# EAGLE board PCIe-1x-Toolcard (EAGLE 9.2.1), part 1 of 3
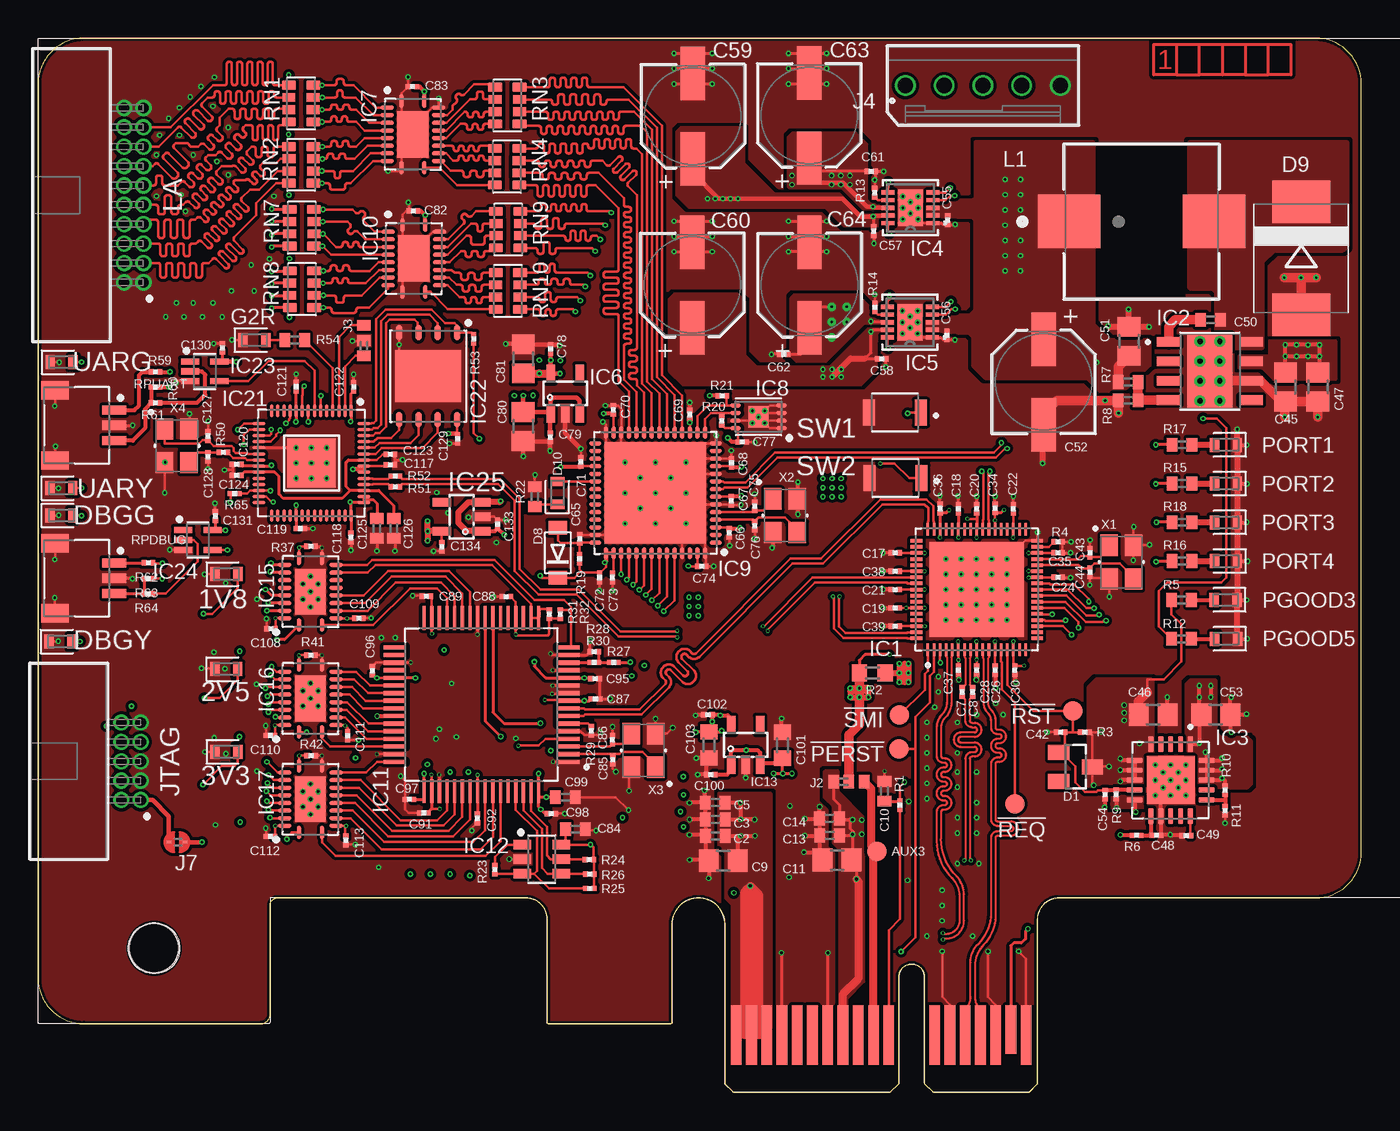
[diagram p8: board, top side]
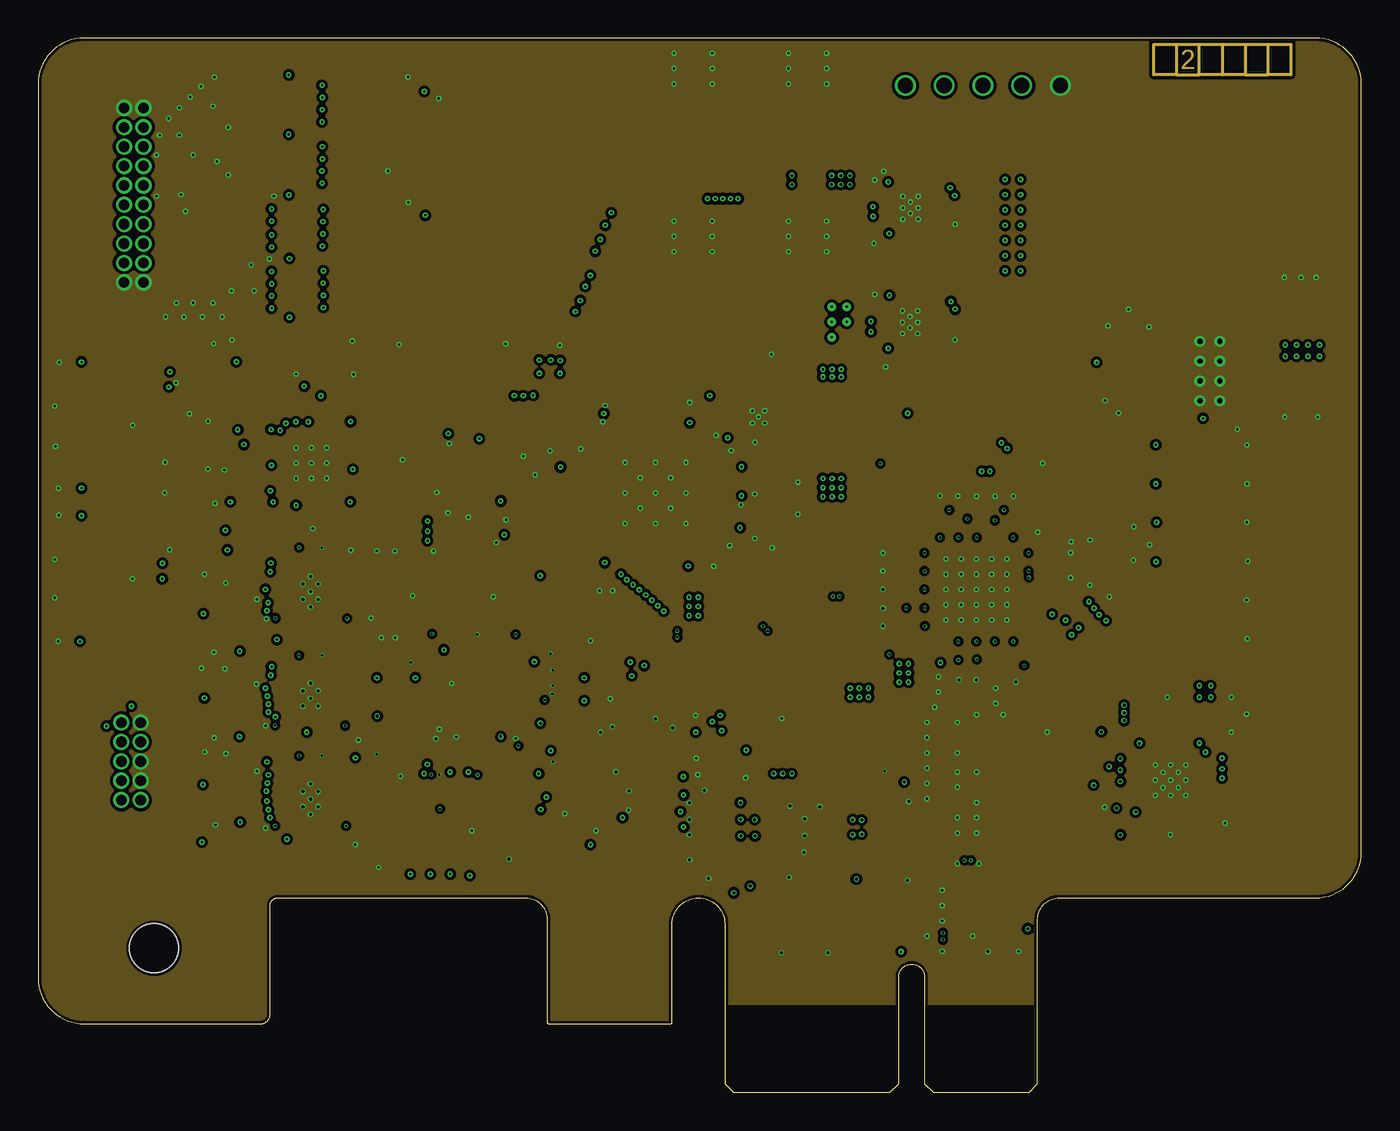
[diagram p9: board, inner layer GND-1]
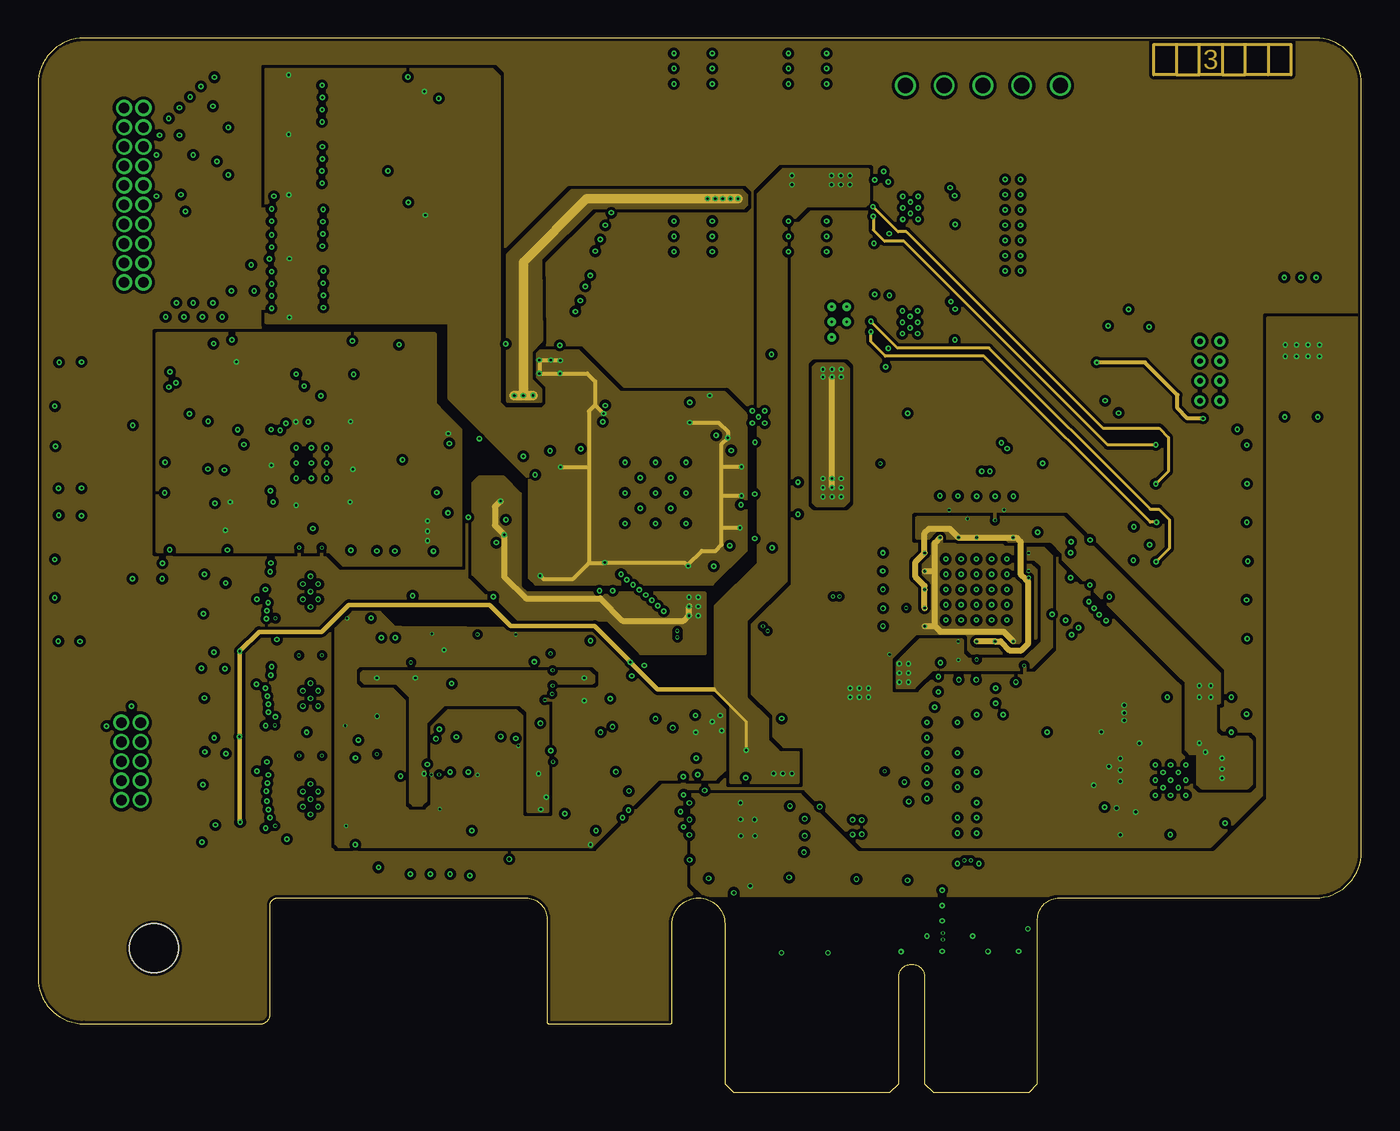
[diagram p10: board, inner layer PWR]
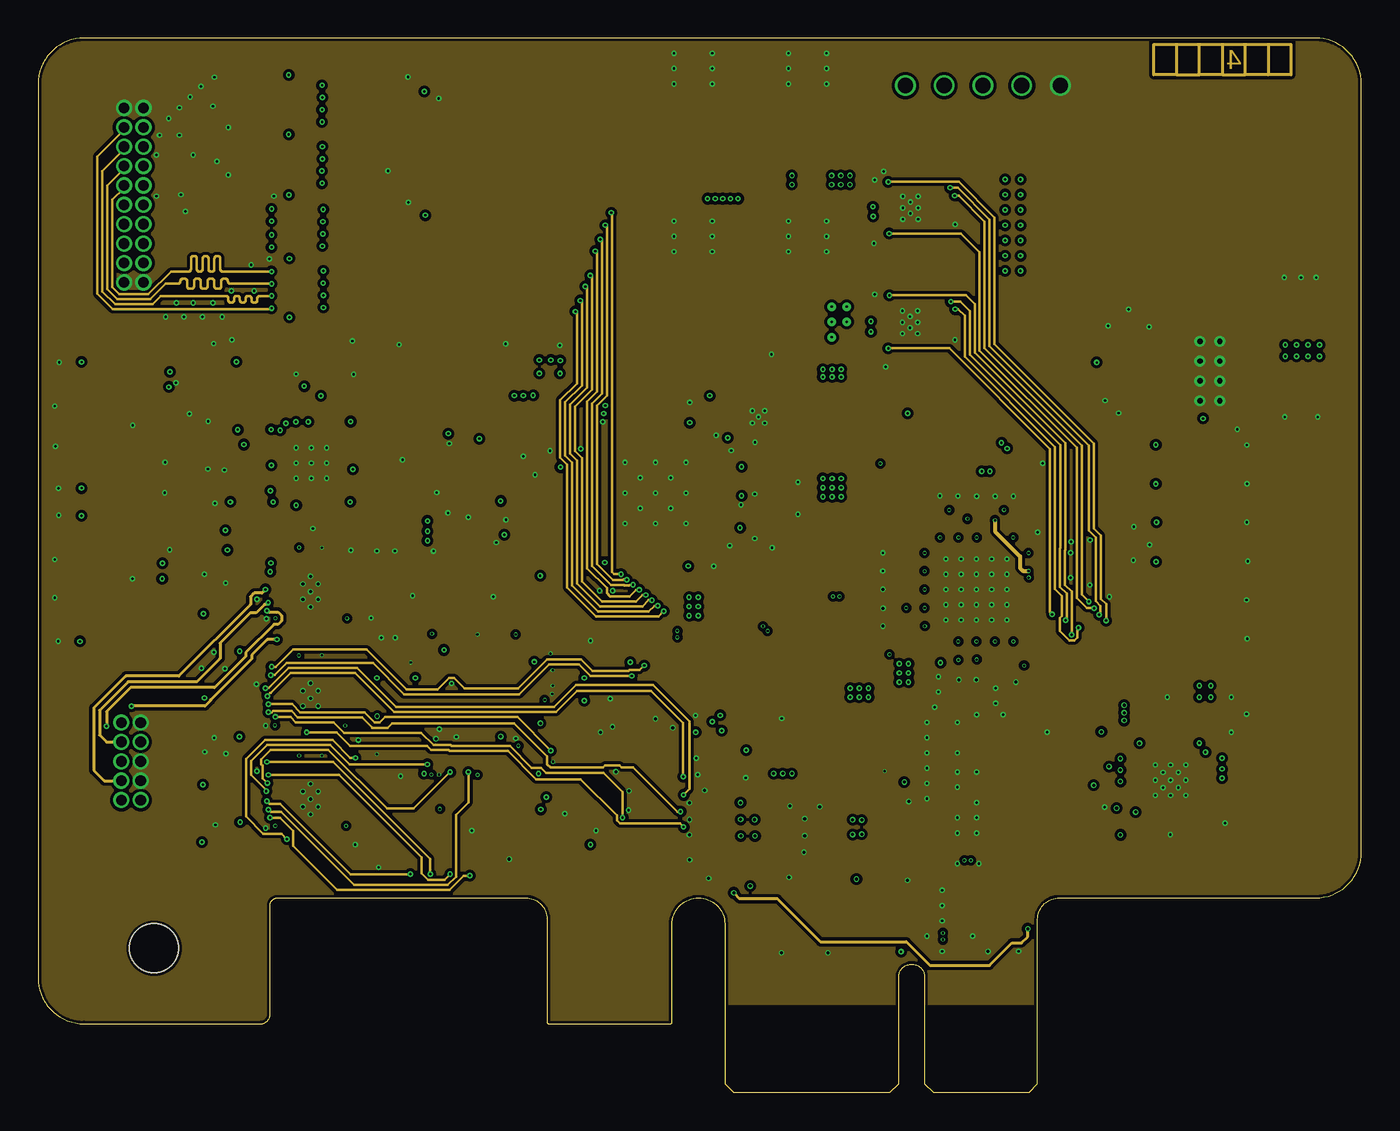
[diagram p11: board, inner layer SIGNAL]
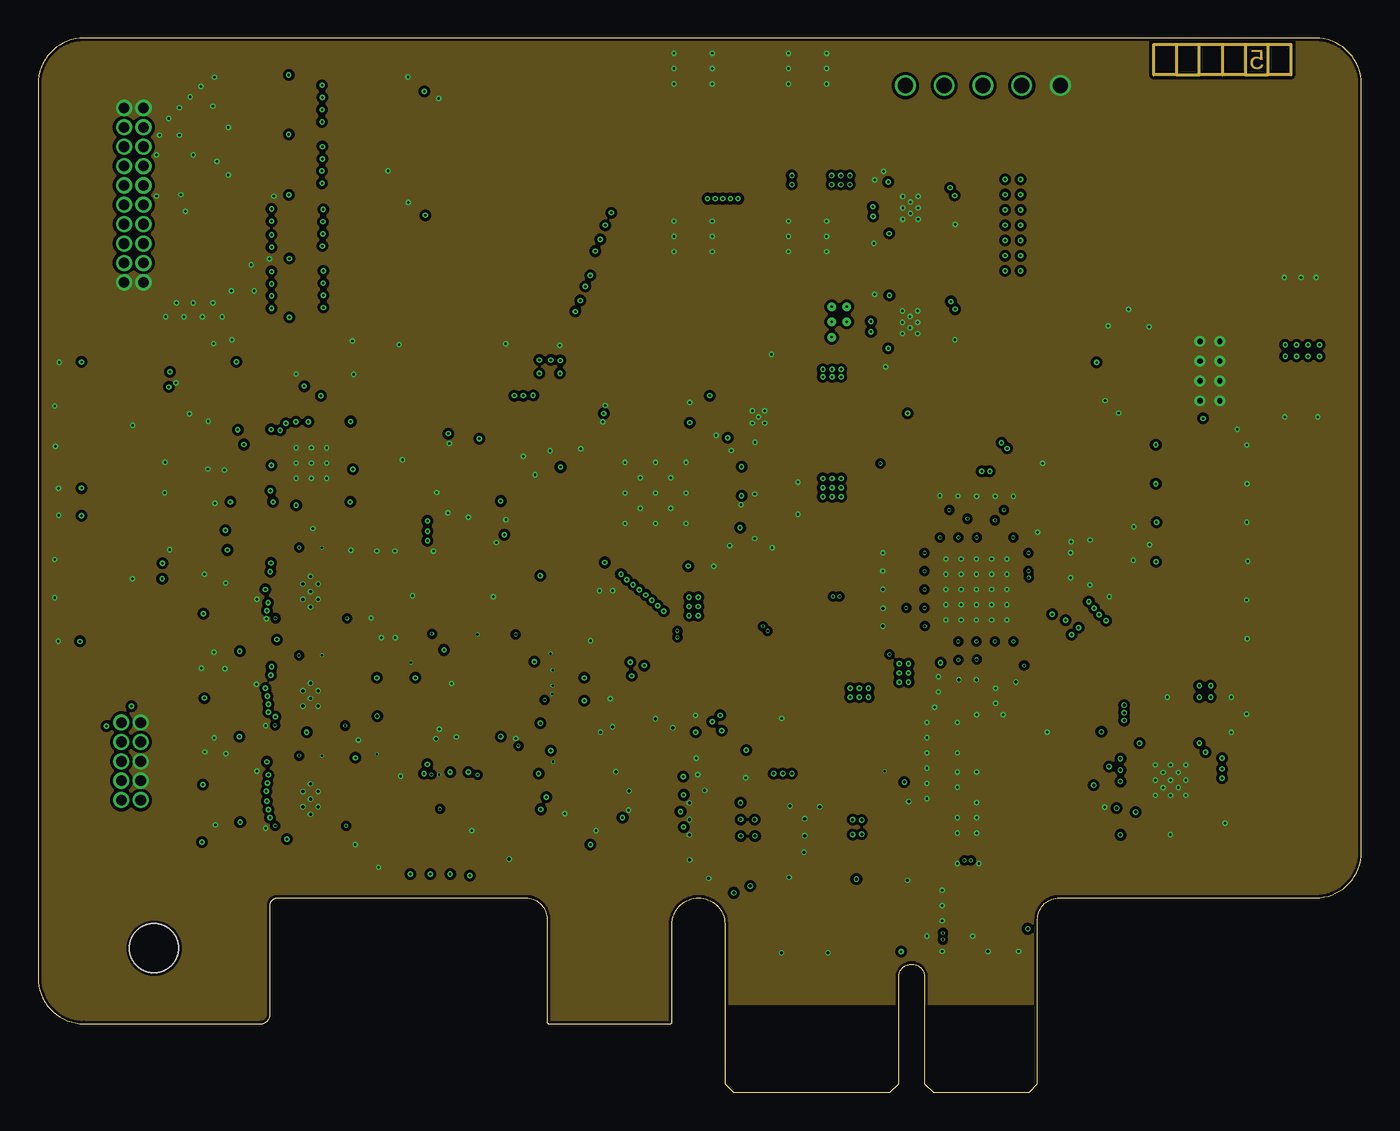
[diagram p12: board, inner layer GND-2]
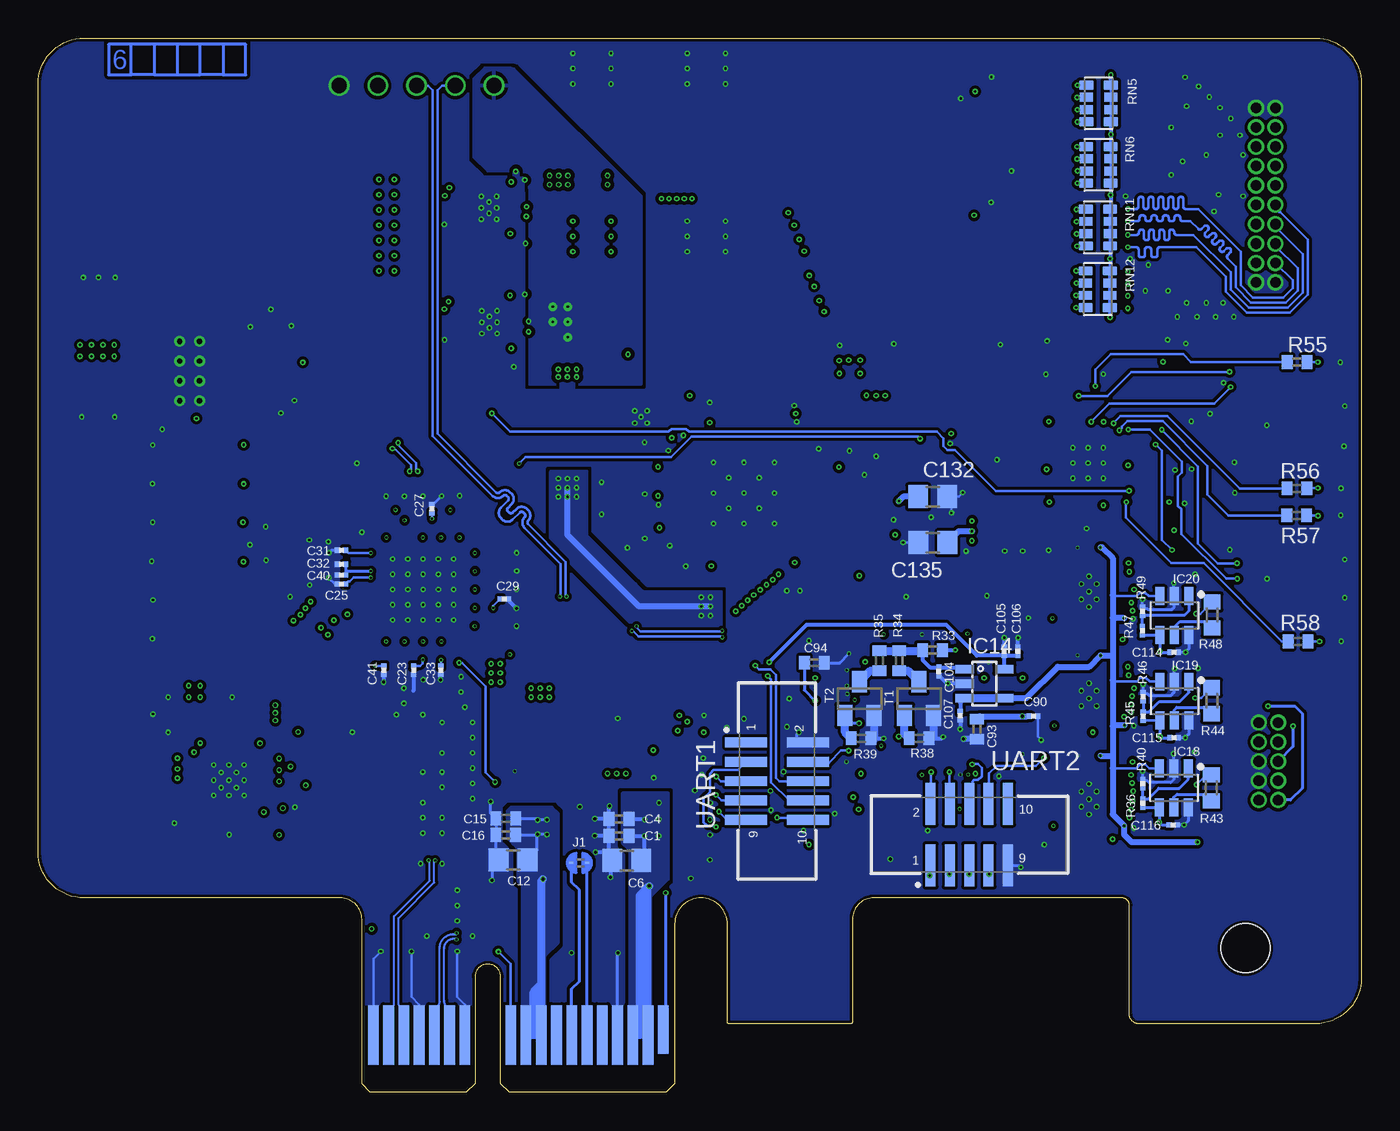
[diagram p13: board, bottom side, seen from below]

Size 86.72 x 69.1 mm. Coordinates in mm from the lower left corner, seen from the top.
Outline: 83.72,69.1 3,69.1 arc90 0,66.1 0,7.5 arc90 3,4.5 14.59,4.5 arc90 15.2,5.11 15.2,12.26 arc-90 15.69,12.75 31.96,12.75 arc-90 33.35,11.37 33.35,4.61 arc90 33.46,4.5 41.44,4.5 arc90 41.55,4.61 41.55,11.03 arc-90 43.27,12.75 43.29,12.75 arc-90 45,11.04 45,0.56 45.56,0 55.84,0 56.4,0.56 56.4,7.56 arc-90 57.25,8.41 arc-90 58.1,7.56 58.1,0.56 58.66,0 64.95,0 65.5,0.55 65.5,11.33 arc-90 66.92,12.75 83.72,12.75 arc90 86.72,15.75 86.72,66.1 arc90 83.72,69.1
Copper layers (1+2*3+14*15+16): SIGNAL-HS 0.035mm / dielectric 0.0994mm / GND-1 0.0152mm / dielectric 0.55mm / PWR 0.0152mm / dielectric 0.1088mm / SIGNAL 0.0152mm / dielectric 0.55mm / GND-2 0.0152mm / dielectric 0.0994mm / SIGNAL-HS2 0.035mm
Design rules "JLC06161H-3313A_6-layer_1.6 mm *": minimum track width 0.1mm, minimum drill 0.15mm, track to track 3.5mil, track to pad 3.5mil, pad to pad 3.5mil, via to via 3.5mil, smd to smd 3.5mil, copper to edge 0.2mm, drill to drill 6mil, minimum pad ring 7mil, minimum via ring 0.05mm, stop-mask expansion 0.05mm, vias tented up to drill 16mil, thermal gap 10mil
Net classes: 0 50R_SE: width 0.149 mm, drill 0.15 mm, clearance 0.178 mm; 1 90R_DE: width 0.149 mm, drill 0.15 mm, clearance 0.178 mm; 2 100R_DE: width 0.115 mm, drill 0.15 mm, clearance 0.178 mm; 3 50R_SE_INNER: width 0.369 mm, drill 0.15 mm, clearance 0.178 mm

## Footprints (pad centres in the part's own frame; a part is rotated, then mirrored left to right if it is on the bottom)
LED-0603 = smd 0.612 x 0.912: A 0.75,0; C -0.75,0
B1,27 = smd 1.27 x 1.27: TP 0,0
0402 = smd 0.7 x 0.9: 1 -0.65,0; 2 0.65,0
0805 = smd 1.3 x 1.5: 1 -0.95,0; 2 0.95,0
0201 = smd 0.34 x 0.35: 1 -0.275,0; 2 0.275,0
C0402 = smd 0.7 x 0.9: 1 -0.65,0; 2 0.65,0
6.3X7.7(DXL) = smd 3.5 x 1.6: 1 2.8,0; 2 -2.8,0
6.3X5.5(DXL) = smd 3.5 x 1.6: 1 2.8,0; 2 -2.8,0
0603 = smd 1 x 1.1: 1 -0.85,0; 2 0.85,0
SOT23 = smd 1 x 1.4: 1 -0.95,-1.1; 2 0.95,-1.1; 3 0,1.1
SOD-123FL = smd 0.91 x 1.22: A 1.637,0; C -1.637,0
SMC = smd 2.8 x 3.8: A 3.7,0; C -3.7,0
QFN68-8X8 = smd 0.81 x 0.22: 1 -3.95,3.2; 2 -3.95,2.8; 3 -3.95,2.4; 4 -3.95,2; 5 -3.95,1.6; 6 -3.95,1.2; 7 -3.95,0.8; 8 -3.95,0.4; 9 -3.95,0; 10 -3.95,-0.4; 11 -3.95,-0.8; 12 -3.95,-1.2; 13 -3.95,-1.6; 14 -3.95,-2; 15 -3.95,-2.4; 16 -3.95,-2.8; 17 -3.95,-3.2; 35 3.95,-3.2; 36 3.95,-2.8; 37 3.95,-2.4; 38 3.95,-2; 39 3.95,-1.6; 40 3.95,-1.2; 41 3.95,-0.8; 42 3.95,-0.4; 43 3.95,0; 44 3.95,0.4; 45 3.95,0.8; 46 3.95,1.2; 47 3.95,1.6; 48 3.95,2; 49 3.95,2.4; 50 3.95,2.8; 51 3.95,3.2 | smd 0.22 x 0.81: 18 -3.2,-3.95; 19 -2.8,-3.95; 20 -2.4,-3.95; 21 -2,-3.95; 22 -1.6,-3.95; 23 -1.2,-3.95; 24 -0.8,-3.95; 25 -0.4,-3.95; 26 0,-3.95; 27 0.4,-3.95; 28 0.8,-3.95; 29 1.2,-3.95; 30 1.6,-3.95; 31 2,-3.95; 32 2.4,-3.95; 33 2.8,-3.95; 34 3.2,-3.95; 52 3.2,3.95; 53 2.8,3.95; 54 2.4,3.95; 55 2,3.95; 56 1.6,3.95; 57 1.2,3.95; 58 0.8,3.95; 59 0.4,3.95; 60 0,3.95; 61 -0.4,3.95; 62 -0.8,3.95; 63 -1.2,3.95; 64 -1.6,3.95; 65 -2,3.95; 66 -2.4,3.95; 67 -2.8,3.95; 68 -3.2,3.95 | smd 6.2 x 6.2: 69 0,0
8-POWERSOIC = smd 1.55 x 0.6: 1 -2.7,1.905; 2 -2.7,0.635; 3 -2.7,-0.635; 4 -2.7,-1.905; 5 2.7,-1.905; 6 2.7,-0.635; 7 2.7,0.635; 8 2.7,1.905 | smd 2.95 x 4.9: PAD 0,0 | drill 0.35 pad 0.61: V1 -0.65,1.95; V2 0.65,1.95; V3 -0.65,0.65; V4 0.65,0.65; V5 -0.65,-0.65; V6 0.65,-0.65; V7 -0.65,-1.95; V8 0.65,-1.95
VQFN20-5X5 = smd 1.05 x 0.34: 1 -2.36,1.3; 2 -2.36,0.65; 3 -2.36,0; 4 -2.36,-0.65; 5 -2.36,-1.3; 11 2.36,-1.3; 12 2.36,-0.65; 13 2.36,0; 14 2.36,0.65; 15 2.36,1.3 | smd 0.34 x 1.05: 6 -1.3,-2.36; 7 -0.65,-2.36; 8 0,-2.36; 9 0.65,-2.36; 10 1.3,-2.36; 16 1.3,2.36; 17 0.65,2.36; 18 0,2.36; 19 -0.65,2.36; 20 -1.3,2.36 | smd 3.15 x 3.15: 21 0,0
VSON10-3X3 = smd 0.85 x 0.28: 1 -1.475,1; 2 -1.475,0.5; 3 -1.475,0; 4 -1.475,-0.5; 5 -1.475,-1; 6 1.475,-1; 7 1.475,-0.5; 8 1.475,0; 9 1.475,0.5; 10 1.475,1 | smd 1.65 x 2.4: PAD 0,0
SOT23-5 = smd 0.55 x 1.2: 1 -0.95,-1.3; 2 0,-1.3; 3 0.95,-1.3; 4 0.95,1.3; 5 -0.95,1.3
QFN50P350X450X100-25T305X205N = smd 0.264 x 0.896: 1 -0.75,2.187; 10 -0.75,-2.187; 11 0.75,-2.187; 20 0.75,2.187 | smd 0.896 x 0.264: 2 -1.687,1.75; 3 -1.687,1.25; 4 -1.687,0.75; 5 -1.687,0.25; 6 -1.687,-0.25; 7 -1.687,-0.75; 8 -1.687,-1.25; 9 -1.687,-1.75; 12 1.687,-1.75; 13 1.687,-1.25; 14 1.687,-0.75; 15 1.687,-0.25; 16 1.687,0.25; 17 1.687,0.75; 18 1.687,1.25; 19 1.687,1.75 | smd 2.05 x 3.05: PAD 0,0
SON50P300X200X50-9T130X140N = smd 0.711 x 0.27: 1 -1.501,0.75; 2 -1.501,0.25; 3 -1.501,-0.25; 4 -1.501,-0.75; 5 1.501,-0.75; 6 1.501,-0.25; 7 1.501,0.25; 8 1.501,0.75 | smd 1.3 x 1.4: 9 0,0
QFN50P800X800X100-57T665 = smd 0.811 x 0.264: 1 -3.951,3.25; 2 -3.951,2.75; 3 -3.951,2.25; 4 -3.951,1.75; 5 -3.951,1.25; 6 -3.951,0.75; 7 -3.951,0.25; 8 -3.951,-0.25; 9 -3.951,-0.75; 10 -3.951,-1.25; 11 -3.951,-1.75; 12 -3.951,-2.25; 13 -3.951,-2.75; 14 -3.951,-3.25; 29 3.951,-3.25; 30 3.951,-2.75; 31 3.951,-2.25; 32 3.951,-1.75; 33 3.951,-1.25; 34 3.951,-0.75; 35 3.951,-0.25; 36 3.951,0.25; 37 3.951,0.75; 38 3.951,1.25; 39 3.951,1.75; 40 3.951,2.25; 41 3.951,2.75; 42 3.951,3.25 | smd 0.264 x 0.811: 15 -3.25,-3.951; 16 -2.75,-3.951; 17 -2.25,-3.951; 18 -1.75,-3.951; 19 -1.25,-3.951; 20 -0.75,-3.951; 21 -0.25,-3.951; 22 0.25,-3.951; 23 0.75,-3.951; 24 1.25,-3.951; 25 1.75,-3.951; 26 2.25,-3.951; 27 2.75,-3.951; 28 3.25,-3.951; 43 3.25,3.951; 44 2.75,3.951; 45 2.25,3.951; 46 1.75,3.951; 47 1.25,3.951; 48 0.75,3.951; 49 0.25,3.951; 50 -0.25,3.951; 51 -0.75,3.951; 52 -1.25,3.951; 53 -1.75,3.951; 54 -2.25,3.951; 55 -2.75,3.951; 56 -3.25,3.951 | smd 6.65 x 6.65: 57 0,0
LQFP64-10X10 = smd 1.56 x 0.28: 1 -5.68,3.75; 2 -5.68,3.25; 3 -5.68,2.75; 4 -5.68,2.25; 5 -5.68,1.75; 6 -5.68,1.25; 7 -5.68,0.75; 8 -5.68,0.25; 9 -5.68,-0.25; 10 -5.68,-0.75; 11 -5.68,-1.25; 12 -5.68,-1.75; 13 -5.68,-2.25; 14 -5.68,-2.75; 15 -5.68,-3.25; 16 -5.68,-3.75; 33 5.68,-3.75; 34 5.68,-3.25; 35 5.68,-2.75; 36 5.68,-2.25; 37 5.68,-1.75; 38 5.68,-1.25; 39 5.68,-0.75; 40 5.68,-0.25; 41 5.68,0.25; 42 5.68,0.75; 43 5.68,1.25; 44 5.68,1.75; 45 5.68,2.25; 46 5.68,2.75; 47 5.68,3.25; 48 5.68,3.75 | smd 0.28 x 1.56: 17 -3.75,-5.68; 18 -3.25,-5.68; 19 -2.75,-5.68; 20 -2.25,-5.68; 21 -1.75,-5.68; 22 -1.25,-5.68; 23 -0.75,-5.68; 24 -0.25,-5.68; 25 0.25,-5.68; 26 0.75,-5.68; 27 1.25,-5.68; 28 1.75,-5.68; 29 2.25,-5.68; 30 2.75,-5.68; 31 3.25,-5.68; 32 3.75,-5.68; 49 3.75,5.68; 50 3.25,5.68; 51 2.75,5.68; 52 2.25,5.68; 53 1.75,5.68; 54 1.25,5.68; 55 0.75,5.68; 56 0.25,5.68; 57 -0.25,5.68; 58 -0.75,5.68; 59 -1.25,5.68; 60 -1.75,5.68; 61 -2.25,5.68; 62 -2.75,5.68; 63 -3.25,5.68; 64 -3.75,5.68
SOT95P280X145-6N = smd 1.165 x 0.597: 1 -1.275,0.95; 2 -1.275,0; 3 -1.275,-0.95; 4 1.275,-0.95; 5 1.275,0; 6 1.275,0.95
VQFN24 = smd 0.264 x 0.896: 1 -0.75,-2.187; 10 -0.75,2.187; 11 0.75,2.187; 20 0.75,-2.187 | smd 0.896 x 0.264: 2 -1.687,-1.75; 3 -1.687,-1.25; 4 -1.687,-0.75; 5 -1.687,-0.25; 6 -1.687,0.25; 7 -1.687,0.75; 8 -1.687,1.25; 9 -1.687,1.75; 12 1.687,1.75; 13 1.687,1.25; 14 1.687,0.75; 15 1.687,0.25; 16 1.687,-0.25; 17 1.687,-0.75; 18 1.687,-1.25; 19 1.687,-1.75 | smd 2 x 3: PAD 0,0
QFN56 = smd 0.837 x 0.22: 1 -3.437,2.6; 2 -3.437,2.2; 3 -3.437,1.8; 4 -3.437,1.4; 5 -3.437,1; 6 -3.437,0.6; 7 -3.437,0.2; 8 -3.437,-0.2; 9 -3.437,-0.6; 10 -3.437,-1; 11 -3.437,-1.4; 12 -3.437,-1.8; 13 -3.437,-2.2; 14 -3.437,-2.6; 29 3.437,-2.6; 30 3.437,-2.2; 31 3.437,-1.8; 32 3.437,-1.4; 33 3.437,-1; 34 3.437,-0.6; 35 3.437,-0.2; 36 3.437,0.2; 37 3.437,0.6; 38 3.437,1; 39 3.437,1.4; 40 3.437,1.8; 41 3.437,2.2; 42 3.437,2.6 | smd 0.22 x 0.837: 15 -2.6,-3.437; 16 -2.2,-3.437; 17 -1.8,-3.437; 18 -1.4,-3.437; 19 -1,-3.437; 20 -0.6,-3.437; 21 -0.2,-3.437; 22 0.2,-3.437; 23 0.6,-3.437; 24 1,-3.437; 25 1.4,-3.437; 26 1.8,-3.437; 27 2.2,-3.437; 28 2.6,-3.437; 43 2.6,3.437; 44 2.2,3.437; 45 1.8,3.437; 46 1.4,3.437; 47 1,3.437; 48 0.6,3.437; 49 0.2,3.437; 50 -0.2,3.437; 51 -0.6,3.437; 52 -1,3.437; 53 -1.4,3.437; 54 -1.8,3.437; 55 -2.2,3.437; 56 -2.6,3.437 | smd 3.2 x 3.2: PAD 0,0
SON127P600X500X75-8N = smd 1.012 x 0.432: 1 -2.85,1.905; 2 -2.85,0.635; 3 -2.85,-0.635; 4 -2.85,-1.905; 5 2.85,-1.905; 6 2.85,-0.635; 7 2.85,0.635; 8 2.85,1.905 | smd 3.4 x 4.3: PAD 0,0
SOT353-1 = smd 1.186 x 0.397: 1 -0.962,0.65; 2 -0.962,0; 3 -0.962,-0.65; 4 0.962,-0.65; 5 0.962,0.65
J-0402-NO = smd 0.305 x 0.152: 1 -0.5,0; 2 0.55,0
JUMPER-3 = smd 0.7 x 0.9: 1 -0.65,0; 2 0.35,0; 3 1.35,0
66100511622 = drill 1: 1 5.08,0; 2 2.54,0; 3 0,0; 4 -2.54,0; 5 -5.08,0
62701021721 = drill 0.7 pad 1.05: 1 2.54,4.72; 2 2.54,3.45; 3 1.27,4.72; 4 1.27,3.45; 5 0,4.72; 6 0,3.45; 7 -1.27,4.72; 8 -1.27,3.45; 9 -2.54,4.72; 10 -2.54,3.45
L-10X10 = smd 4.1 x 3.5: 1 -4.75,0; 2 4.75,0
62702021721 = drill 0.7 pad 1.05: 1 5.715,4.72; 2 5.715,3.45; 3 4.445,4.72; 4 4.445,3.45; 5 3.175,4.72; 6 3.175,3.45; 7 1.905,4.72; 8 1.905,3.45; 9 0.635,4.72; 10 0.635,3.45; 11 -0.635,4.72; 12 -0.635,3.45; 13 -1.905,4.72; 14 -1.905,3.45; 15 -3.175,4.72; 16 -3.175,3.45; 17 -4.445,4.72; 18 -4.445,3.45; 19 -5.715,4.72; 20 -5.715,3.45
PCIE_X1_LOWPROFILE = smd 0.7 x 3.2 bottom: A1 45.75,-0.38 | smd 0.7 x 3.91 bottom: A2 46.75,-0.735; A3 47.75,-0.735; A4 48.75,-0.735; A5 49.75,-0.735; A6 50.75,-0.735; A7 51.75,-0.735; A8 52.75,-0.735; A9 53.75,-0.735; A10 54.75,-0.735; A11 55.75,-0.735; A12 58.75,-0.735; A13 59.75,-0.735; A14 60.75,-0.735; A15 61.75,-0.735; A16 62.75,-0.735; A17 63.75,-0.735; A18 64.75,-0.735 | smd 0.7 x 3.91: B1 45.75,-0.735; B2 46.75,-0.735; B3 47.75,-0.735; B4 48.75,-0.735; B5 49.75,-0.735; B6 50.75,-0.735; B7 51.75,-0.735; B8 52.75,-0.735; B9 53.75,-0.735; B10 54.75,-0.735; B11 55.75,-0.735; B12 58.75,-0.735; B13 59.75,-0.735; B14 60.75,-0.735; B15 61.75,-0.735; B16 62.75,-0.735; B18 64.75,-0.735 | smd 0.7 x 3.2: B17 63.75,-0.38 | hole 3.2: 7.6,4.95
0603X4-1206 = smd 0.59 x 0.92: A1 -1.2,-0.8; A2 -1.2,0.8; B1 -0.4,-0.8; B2 -0.4,0.8; C1 0.4,-0.8; C2 0.4,0.8; D1 1.2,-0.8; D2 1.2,0.8
SM03B-SRSS-TB = smd 0.6 x 1.55: 1 -1,2.54; 2 0,2.54; 3 1,2.54 | smd 1.2 x 1.8: S1 -2.3,-1.335; S2 2.3,-1.335
B3U-1000P = smd 0.8 x 1.7: 1 -1.7,0; 2 1.7,0
62731020621 = smd 0.65 x 2.76: 1 -2.54,-2.02; 2 -2.54,2.02; 3 -1.27,-2.02; 4 -1.27,2.02; 5 0,-2.02; 6 0,2.02; 7 1.27,-2.02; 8 1.27,2.02; 9 2.54,-2.02; 10 2.54,2.02
WE-XTAL_CFPX-180 = smd 1.4 x 1.15: 1 -1.1,-0.8; 2 1.1,-0.8; 3 1.1,0.8; 4 -1.1,0.8

## Placement (x,y rotation side)
1V8  Green  [LED-0603]  12.34,33.97 0 top
2V5  Green  [LED-0603]  12.33,27.75 0 top
3V3  Green  [LED-0603]  12.34,22.33 0 top
!PERST  TPB1,27  [B1,27]  56.42,22.51 90 top
!REQ  TPB1,27  [B1,27]  64.01,18.9 0 top
!RST  TPB1,27  [B1,27]  67.8,25.01 0 top
!SMI  TPB1,27  [B1,27]  56.46,24.74 90 top
AUX3  TPB1,27  [B1,27]  54.96,15.8 0 top
C1  100nF 25V  [0402]  48.65,16.82 180 bottom
C2  100nF 25V  [0402]  44.39,16.81 180 top
C3  100nF 25V  [0402]  44.38,17.9 180 top
C4  100nF 25V  [0402]  48.65,17.92 180 bottom
C5  100nF 25V  [0402]  44.37,19 180 top
C6  10uF 50V  [0805]  48.14,15.2 180 bottom
C7  100nF 16V  [0201]  60.56,26.25 270 top
C8  100nF 16V  [0201]  61.25,26.25 270 top
C9  10uF 50V  [0805]  44.9,15.19 180 top
C10  1nF  [C0402]  55.47,19.74 90 top
C11  10uF 50V  [0805]  52.36,15.23 180 top
C12  10uF 50V  [0805]  55.59,15.24 180 bottom
C13  100nF 25V  [0402]  51.87,16.84 180 top
C14  100nF 25V  [0402]  51.86,17.96 180 top
C15  100nF 25V  [0402]  56.07,17.96 180 bottom
C16  100nF 25V  [0402]  56.08,16.88 180 bottom
C17  10nF 16V  [0201]  56.18,35.36 180 top
C18  10nF 16V  [0201]  60.31,38.26 90 top
C19  10nF 16V  [0201]  56.17,31.75 180 top
C20  10nF 16V  [0201]  61.51,38.26 90 top
C21  10nF 16V  [0201]  56.17,32.96 180 top
C22  10nF 16V  [0201]  63.91,38.26 90 top
C23  100nF 16V  [0201]  62.11,27.67 270 bottom
C24  10nF 16V  [0201]  66.85,33.76 0 top
C25  100nF 16V  [0201]  66.85,33.32 180 bottom
C26  10nF 16V  [0201]  62.72,27.67 270 top
C27  100nF 16V  [0201]  60.91,38.26 90 bottom
C28  10nF 16V  [0201]  61.51,27.67 270 top
C29  100nF 16V  [0201]  56.16,32.34 0 bottom
C30  10nF 16V  [0201]  64.01,27.68 270 top
C31  100nF 16V  [0201]  66.84,35.54 180 bottom
C32  10nF 16V  [0201]  66.84,34.62 180 bottom
C33  100nF 16V  [0201]  60.33,27.67 270 bottom
C34  10nF 16V  [0201]  62.71,38.28 90 top
C35  10nF 16V  [0201]  66.84,35.36 0 top
C36  10nF 16V  [0201]  59.11,38.27 90 top
C37  10nF 16V  [0201]  60.31,27.67 270 top
C38  10nF 16V  [0201]  56.17,34.16 180 top
C39  10nF 16V  [0201]  56.17,30.56 180 top
C40  100nF 16V  [0201]  66.84,33.91 180 bottom
C41  100nF 16V  [0201]  64.06,27.68 270 bottom
C42  1uF 16V  [0201]  67,23.61 180 top
C43  8pF 50V  [0201]  68.93,35.37 90 top
C44  8pF 50V  [0201]  68.93,34.08 270 top
C45  22uF 25V  [0805]  81.75,46.23 270 top
C46  10uF 16V  [0805]  73.07,24.76 0 top
C47  10nF 50V  [0805]  83.87,46.24 270 top
C48  10nF 16V  [0201]  73.29,16.85 0 top
C49  DNI  [0201]  75.25,16.84 180 top
C50  10nF 25V  [0402]  76.84,50.64 0 top
C51  10nF 50V  [0805]  71.49,49.23 90 top
C52  330uF 25V  [6.3X7.7(DXL)]  65.9,46.57 90 top
C53  22uF 16V  [0805]  77.18,24.76 0 top
C54  100nF 16V  [0201]  69.93,19.52 270 top
C55  100nF 16V  [0201]  59.6,57.17 270 top
C56  100nF 16V  [0201]  59.56,49.61 270 top
C57  100nF 16V  [0201]  54.77,56.45 270 top
C58  100nF 16V  [0201]  55.27,48.07 0 top
C59  150uF 35V  [6.3X5.5(DXL)]  42.91,63.99 270 top
C60  150uF 35V  [6.3X5.5(DXL)]  42.86,52.92 270 top
C61  100nF 16V  [0201]  54.59,60.37 0 top
C62  100nF 16V  [0201]  48.87,48.38 180 top
C63  150uF 35V  [6.3X5.5(DXL)]  50.53,64.03 270 top
C64  150uF 35V  [6.3X5.5(DXL)]  50.55,52.91 270 top
C65  1uF 16V  [0201]  35.49,36.29 90 top
C66  100nF 25V  [0201]  45.3,36.67 270 top
C67  100nF 25V  [0201]  45.43,38.79 270 top
C68  100nF 25V  [0201]  45.44,41.26 90 top
C69  100nF 25V  [0201]  42.71,44.43 90 top
C70  100nF 25V  [0201]  37.7,44.74 90 top
C71  100nF 25V  [0201]  35.57,41.32 90 top
C72  100nF 25V  [0201]  36.79,33.75 270 top
C73  100nF 25V  [0201]  37.64,33.75 270 top
C74  100nF 25V  [0201]  43.49,34.48 0 top
C75  12pF 50V  [0201]  46.97,38.42 90 top
C76  12pF 50V  [0201]  46.97,37.15 270 top
C77  100nF 25V  [0201]  46.14,42.63 0 top
C78  100nF 25V  [0201]  33.58,48.73 90 top
C79  100nF 25V  [0201]  33.56,42.95 270 top
C80  10uF 50V  [0805]  31.79,43.65 270 top
C81  10uF 50V  [0805]  31.8,48.08 90 top
C82  100nF 25V  [0201]  24.59,57.77 180 top
C83  100nF 25V  [0201]  24.53,65.92 180 top
C84  100nF 25V  [0402]  35.21,17.26 0 top
C85  27pF 50V  [0201]  37.65,21.8 270 top
C86  27pF 50V  [0201]  37.64,23.11 90 top
C87  100nF 25V  [0201]  36.53,25.79 0 top
C88  100nF 25V  [0201]  30.68,32.5 180 top
C89  100nF 25V  [0201]  25.43,32.52 180 top
C90  100nF 25V  [0201]  21.48,24.66 0 bottom
C91  100nF 25V  [0201]  25.27,18.32 180 top
C92  100nF 25V  [0201]  28.79,17.96 270 top
C93  4.7uF 25V  [0402]  25.2,23.81 270 bottom
C94  4.7uF 25V  [0402]  35.85,28.16 0 bottom
C95  100nF 25V  [0201]  36.5,27.12 0 top
C96  100nF 25V  [0201]  21.91,27.64 90 top
C97  100nF 25V  [0201]  24.34,19.21 180 top
C98  100nF 25V  [0201]  33.64,18.27 0 top
C99  4.7uF 25V  [0402]  34.55,19.35 0 top
C100  100nF 25V  [0201]  44.07,20.83 180 top
C101  10uF 16V  [0603]  48.79,22.76 90 top
C102  100nF 25V  [0201]  43.9,24.75 180 top
C103  10uF 16V  [0603]  43.96,22.78 270 top
C104  1uF 16V  [0201]  27.69,27.59 270 bottom
C105  1uF 16V  [0201]  23.41,28.91 90 bottom
C106  100nF 25V  [0201]  22.51,28.91 90 bottom
C107  100nF 25V  [0201]  26.29,24.69 270 bottom
C108  100nF 25V  [0201]  15.25,30.4 180 top
C109  100nF 25V  [0201]  21.03,31.08 0 top
C110  100nF 25V  [0201]  15.23,23.4 180 top
C111  100nF 25V  [0201]  20.28,23.37 270 top
C112  100nF 25V  [0201]  15.21,16.78 180 top
C113  100nF 25V  [0201]  20.16,16.52 270 top
C114  100nF 25V  [0201]  12.28,28.85 0 bottom
C115  100nF 25V  [0201]  12.28,23.24 0 bottom
C116  100nF 25V  [0201]  12.33,17.53 0 bottom
C117  100nF 25V  [0201]  23.09,41.13 0 top
C118  100nF 25V  [0201]  20.5,36.37 270 top
C119  100nF 25V  [0201]  17.18,36.96 0 top
C120  100nF 25V  [0201]  13.01,41.16 180 top
C121  100nF 25V  [0201]  16.91,46.26 90 top
C122  100nF 25V  [0201]  20.68,46.24 90 top
C123  100nF 25V  [0201]  23.09,41.82 0 top
C124  100nF 25V  [0201]  13.01,40.44 180 top
C125  4.7uF 25V  [0402]  22.2,36.97 270 top
C126  4.7uF 25V  [0402]  23.31,36.97 270 top
C127  12pF 50V  [0201]  11.13,43.02 90 top
C128  12pF 50V  [0201]  11.13,41.67 270 top
C129  100nF 25V  [0201]  27.49,42.83 270 top
C130  100nF 25V  [0201]  12.08,48.81 90 top
C131  100nF 25V  [0201]  11.61,37.78 90 top
C132  10uF 50V  [0805]  28.1,39.05 0 bottom
C133  100nF 25V  [0201]  30.11,37.25 90 top
C134  100nF 25V  [0201]  26.45,35.76 270 top
C135  10uF 50V  [0805]  28.08,36.03 180 bottom
D1  1SS294  [SOT23]  67.99,21.34 270 top
D8  1N4148SOD-123  [SOD-123FL]  34.06,35.37 90 top
D9  MBRS540T3G  [SMC]  82.77,54.66 270 top
D10  Red  [LED-0603]  34.04,39.29 90 top
DBGG  Green  [LED-0603]  1.52,37.82 0 top
DBGY  Yellow  [LED-0603]  1.47,29.55 0 top
G2R  Red  [LED-0603]  14.18,49.31 0 top
IC1  UPD720201K8-701-BAC-A  [QFN68-8X8]  61.51,32.96 90 top
IC2  TPS5450DDAR  [8-POWERSOIC]  76.79,47.28 0 top
IC3  TPS74401RGWT  [VQFN20-5X5]  74.22,20.47 270 top
IC4  TPS2560DRCR  [VSON10-3X3]  57.17,57.98 180 top
IC5  TPS2560DRCR  [VSON10-3X3]  57.14,50.48 180 top
IC6  MIC5504-3.3YM5-TR  [SOT23-5]  34.54,45.82 0 top
IC7  SN74LVC541ARGYR  [QFN50P350X450X100-25T305X205N]  24.56,62.8 0 top
IC8  CAT24C256HU4IGT3  [SON50P300X200X50-9T130X140N]  47.21,44.28 180 top
IC9  CY7C68013A-56LTXC  [QFN50P800X800X100-57T665]  40.46,39.29 180 top
IC10  SN74LVC541ARGYR  [QFN50P350X450X100-25T305X205N]  24.62,54.66 0 top
IC11  FT4232HL  [LQFP64-10X10]  29.05,25.42 180 top
IC12  93LC56BT-I/OT  [SOT95P280X145-6N]  33.01,15.29 0 top
IC13  MIC5504-3.3YM5  [SOT23-5]  46.37,22.78 0 top
IC14  LMV611MFX/NOPB  [SOT23-5]  24.69,26.79 270 bottom
IC15  TXS0108ERGYR  [VQFN24]  17.85,32.82 0 top
IC16  TXS0108ERGYR  [VQFN24]  17.85,25.82 0 top
IC17  TXS0108ERGYR  [VQFN24]  17.85,19.22 0 top
IC18  TLV3501AIDBVR  [SOT95P280X145-6N]  12.29,19.96 270 bottom
IC19  TLV3501AIDBVR  [SOT95P280X145-6N]  12.25,25.65 270 bottom
IC20  TLV3501AIDBVR  [SOT95P280X145-6N]  12.26,31.26 270 bottom
IC21  RP2040  [QFN56]  17.91,41.25 270 top
IC22  [SON127P600X500X75-8N]  25.56,46.94 270 top
IC23  74AUP1T17GWH  [SOT353-1]  10.92,47.26 0 top
IC24  74AUP1T17GWH  [SOT353-1]  10.47,36.21 0 top
IC25  MIC5504-3.3YM5  [SOT23-5]  27.75,37.74 90 top
J1  JUMPER-NO  [J-0402-NO]  51.22,15.04 180 bottom
J2  JUMPER-3  [JUMPER-3]  52.78,20.37 0 top
J3  JUMPER-3  [JUMPER-3]  21.35,48.93 90 top
J4  66100511622  [66100511622]  61.92,65.99 180 top
J7  JUMPER-NO  [J-0402-NO]  9.12,16.4 180 top
JTAG  62701021721  [62701021721]  2,21.7 270 top
L1  15uH  [L-10X10]  72.31,57.08 0 top
LA  62702021721  [62702021721]  2.18,58.81 270 top
PCIE-1X1  PCI Express x1 Edge Connector  [PCIE_X1_LOWPROFILE]  0,4.5 0 top
PGOOD3  Green  [LED-0603]  77.82,32.28 180 top
PGOOD5  Green  [LED-0603]  77.85,29.73 180 top
PORT1  Red  [LED-0603]  77.84,42.44 180 top
PORT2  Red  [LED-0603]  77.84,39.9 180 top
PORT3  Red  [LED-0603]  77.84,37.36 180 top
PORT4  Red  [LED-0603]  77.84,34.82 180 top
R1  0R 1%  [0201]  56.48,18.83 90 top
R2  BLM21PG600SN1  [0603]  54.67,27.5 0 top
R3  10K 1%  [0201]  68.6,23.61 180 top
R4  1.6K 1%  [0201]  66.84,36.09 0 top
R5  1K 1%  [0402]  74.93,32.28 0 top
R6  4.7K 1%  [0201]  71.99,16.85 0 top
R7  10K 1%  [0402]  71.43,46.56 0 top
R8  3.16K 1%  [0402]  71.43,45.36 180 top
R9  10K 1%  [0201]  70.65,19.53 90 top
R10  1.37K 1%  [0201]  77.79,19.81 270 top
R11  4.42K 1%  [0201]  77.79,18.48 270 top
R12  1K 1%  [0402]  74.93,29.73 0 top
R13  30.9K 1%  [0201]  54.83,58.97 90 top
R14  30.9K 1%  [0201]  54.84,51.45 90 top
R15  1K 1%  [0402]  74.96,39.91 0 top
R16  1K 1%  [0402]  74.96,34.83 0 top
R17  1K 1%  [0402]  74.96,42.45 0 top
R18  1K 1%  [0402]  74.96,37.37 0 top
R19  100K 1%  [0201]  35.48,34.99 90 top
R20  3.3K 1%  [0201]  44.8,44.03 270 top
R21  3.3K 1%  [0201]  44.84,45.66 180 top
R22  1K 1%  [0402]  32.55,39.05 90 top
R23  2K 1%  [0201]  29.94,14.59 270 top
R24  10K 1%  [0201]  36.12,15.25 180 top
R25  10K 1%  [0201]  36.16,13.37 180 top
R26  10K 1%  [0201]  36.15,14.31 180 top
R27  4.7K 1%  [0201]  37.73,28.18 180 top
R28  10K 1%  [0201]  36.44,28.89 180 top
R29  12K 1%  [0201]  36.25,23.7 270 top
R30  1K 1%  [0201]  36.44,28.18 180 top
R31  4.7K 1%  [0201]  33.5,31.33 90 top
R32  4.7K 1%  [0201]  34.22,31.34 90 top
R33  10K 1%  [0402]  28.11,28.99 180 bottom
R34  22K 1%  [0402]  30.29,28.29 270 bottom
R35  10K 1%  [0402]  31.59,28.29 270 bottom
R36  10K 1%  [0201]  14.32,18.96 90 bottom
R37  100K 1%  [0201]  17.88,35.79 0 top
R38  10K 1%  [0402]  28.99,23.21 0 bottom
R39  10K 1%  [0402]  32.79,23.21 0 bottom
R40  15K 1%  [0201]  14.32,20.25 90 bottom
R41  100K 1%  [0201]  17.87,28.66 0 top
R42  100K 1%  [0201]  17.89,22.08 0 top
R43  1K 1%  [0603]  9.83,19.96 90 bottom
R44  1K 1%  [0603]  9.81,25.67 90 bottom
R45  10K 1%  [0201]  14.3,24.65 90 bottom
R46  7.87K 1%  [0201]  14.3,25.94 90 bottom
R47  10K 1%  [0201]  14.35,30.25 90 bottom
R48  1K 1%  [0603]  9.78,31.29 90 bottom
R49  4.3K 1%  [0201]  14.34,31.54 90 bottom
R50  1K 1%  [0201]  12.13,41.95 180 top
R51  27R 1%  [0201]  23.4,39.7 180 top
R52  27R 1%  [0201]  23.4,40.4 0 top
R53  1K 1%  [0201]  28.54,49.39 90 top
R54  1K 1%  [0402]  16.82,49.31 180 top
R55  1K 1%  [0402]  4.21,47.87 0 bottom
R56  1K 1%  [0402]  4.23,39.59 0 bottom
R57  1K 1%  [0402]  4.24,37.82 0 bottom
R58  1K 1%  [0402]  4.14,29.55 0 bottom
R59  100R 1%  [0201]  7.69,47.22 180 top
R60  100R 1%  [0201]  7.69,46.23 180 top
R61  100R 1%  [0201]  7.7,45.2 180 top
R62  100R 1%  [0201]  7.23,34.71 180 top
R63  100R 1%  [0201]  7.23,33.67 180 top
R64  100R 1%  [0201]  7.22,32.69 180 top
R65  10K 1%  [0201]  12.88,39.25 0 top
RN1  100R 1%  [0603X4-1206]  17.23,64.81 270 top
RN2  100R 1%  [0603X4-1206]  17.24,60.79 270 top
RN3  100R 1%  [0603X4-1206]  30.75,64.68 270 top
RN4  100R 1%  [0603X4-1206]  30.73,60.67 270 top
RN5  100K 1%  [0603X4-1206]  17.22,64.82 270 bottom
RN6  100K 1%  [0603X4-1206]  17.23,60.79 270 bottom
RN7  100R 1%  [0603X4-1206]  17.28,56.67 270 top
RN8  100R 1%  [0603X4-1206]  17.29,52.64 270 top
RN9  100R 1%  [0603X4-1206]  30.8,56.55 270 top
RN10  100R 1%  [0603X4-1206]  30.79,52.53 270 top
RN11  100K 1%  [0603X4-1206]  17.26,56.69 270 bottom
RN12  100K 1%  [0603X4-1206]  17.28,52.64 270 bottom
RPDBUG  SM03B-SRSS-TB  [SM03B-SRSS-TB]  2.45,33.7 270 top
RPUART  SM03B-SRSS-TB  [SM03B-SRSS-TB]  2.45,43.72 270 top
SW1  B3U-1000P  [B3U-1000P]  56.15,44.56 180 top
SW2  B3U-1000P  [B3U-1000P]  56.19,40.26 180 top
T1  [SOT23]  28.99,25.81 0 bottom
T2  [SOT23]  32.89,25.81 0 bottom
UARG  Green  [LED-0603]  1.54,47.86 0 top
UART1  62731020621  [62731020621]  38.3,20.4 270 bottom
UART2  62731020621  [62731020621]  25.7,16.9 0 bottom
UARY  Yellow  [LED-0603]  1.52,39.6 0 top
X1  24MHz  [WE-XTAL_CFPX-180]  70.99,34.75 270 top
X2  24MHz  [WE-XTAL_CFPX-180]  48.95,37.8 270 top
X3  12MHz  [WE-XTAL_CFPX-180]  39.67,22.42 90 top
X4  12MHz  [WE-XTAL_CFPX-180]  9.09,42.38 270 top

## Tracks (layer width: path | path; a pad name or v marks a point on that pad's centre or on a via)
4232_RESET
  SIGNAL-HS 0.203: IC11.14 R30.2
4232R_RESET
  SIGNAL-HS 0.203: R28.1 R30.1 R27.2
!CTS1
  SIGNAL-HS 0.149: IC11.41 21.31,25.17 20.41,26.07 IC16.15
!CTS1_OUT  (via drill 0.15 pad 0.35)
  SIGNAL-HS 0.149: IC16.6 15.12,26.07 v15.02,25.98
  SIGNAL 0.149: v15.02,25.98 15.22,26.17 15.23,26.17 16.55,27.49 20.79,27.49 23.33,24.95 33.95,24.95 35.3,26.3 40.18,26.3 42.27,24.2 v42.27,20.7
  SIGNAL-HS2 0.149: v42.27,20.7 41.97,20.4 UART1.5
!CTS2
  SIGNAL-HS 0.149: IC17.15 20.88,19.47 23.2,17.15 26.9,17.15 27.8,18.05 IC11.54
!CTS2_OUT  (via drill 0.15 pad 0.35)
  SIGNAL-HS 0.149: IC17.6 15.23,19.47 v14.95,19.75
  SIGNAL 0.149: v14.95,19.75 14.95,19.82 13.95,20.82 13.95,21.71 15.01,22.77 19.15,22.77 20.42,21.5 v25.5,21.5
  SIGNAL-HS2 0.149: v25.5,21.5 25.47,21.53 25.11,21.53 24.86,21.28 24.86,20.72 25.11,20.47 25.39,20.47 25.5,20.37 25.5,19.12 UART2.6
!DCD1
  SIGNAL-HS 0.149: IC11.45 21.52,23.17 20.12,24.57 IC16.18
!DCD1_OUT  (via drill 0.15 pad 0.35)
  SIGNAL-HS 0.149: IC16.3 15.59,24.57 v15.54,24.62
  SIGNAL 0.149: v15.54,24.62 15.56,24.6 16.54,24.6 16.87,24.27 19.36,24.27 20.05,23.57 25.11,23.57 25.9,22.78 27.02,22.78 27.1,22.7 30.93,22.7 32.35,21.28 32.96,21.28 33.3,20.93 37.07,20.93 38.3,19.7 v38.3,18
  SIGNAL-HS2 0.149: v38.3,18 36.42,18 UART1.10
!DCD2
  SIGNAL-HS 0.149: IC17.18 20.49,17.97 22.52,15.94 28.98,15.94 29.8,16.76 IC11.58
!DCD2_OUT  (via drill 0.15 pad 0.35)
  SIGNAL-HS 0.149: IC17.3 15.23,17.97 v15.2,18
  SIGNAL 0.149: v15.2,18 15.85,18 16.72,17.13 16.72,16.14 19.6,13.27 26.96,13.27 27.89,14.2 v28.3,14.2
  SIGNAL-HS2 0.149: v28.3,14.2 28.24,14.26 UART2.1
!DSR1
  SIGNAL-HS 0.149: IC11.44 21.62,23.67 20.22,25.07 IC16.17
!DSR1_OUT  (via drill 0.15 pad 0.35)
  SIGNAL-HS 0.149: IC16.4 15.33,25.07 15.28,25.02 15.2,25.02 v15.1,24.92
  SIGNAL 0.149: v15.1,24.92 15.31,24.92 15.39,24.99 16.61,24.99 17.01,24.59 21.23,24.59 21.9,23.92 21.9,23.9 22.9,23.9 23.2,24.2 31.2,24.2 33.36,22.04 33.36,21.51 33.58,21.29 37.03,21.29 37.16,21.42 38.1,21.42 38.22,21.3 39,21.3 41.9,18.4 v42.1,18.4
  SIGNAL-HS2 0.149: v42.1,18.4 41.56,17.86 UART1.9
!DSR2
  SIGNAL-HS 0.149: IC17.17 20.62,18.47 22.68,16.41 28.52,16.41 29.3,17.19 IC11.57
!DSR2_OUT  (via drill 0.15 pad 0.35)
  SIGNAL-HS 0.149: IC17.4 15.17,18.47 v15.1,18.54
  SIGNAL 0.149: v15.1,18.54 15.27,18.38 15.94,18.38 20.72,13.6 26.83,13.6 27.38,14.14 27.38,18.18 28.2,19 v28.2,21
  SIGNAL-HS2 0.149: v28.2,21 28.2,18.96 UART2.2
!DTR1
  SIGNAL-HS 0.149: IC11.43 21.65,24.17 20.25,25.57 IC16.16
!DTR1_OUT  (via drill 0.15 pad 0.35)
  SIGNAL-HS 0.149: 16.13,25.6 IC16.5 15.22,25.57 15.2,25.55 | 15.2,25.55 | 15.2,25.55 v15.1,25.45
  SIGNAL 0.149: v15.1,25.45 16.65,25.45 17.18,24.92 21.39,24.92 22.05,24.26 22.39,24.26 22.73,24.6 31.4,24.6 v33.6,22.41
  SIGNAL-HS2 0.149: v33.6,22.41 34.09,22.41 34.9,21.6 36.21,21.6 UART1.4
!DTR2
  SIGNAL-HS 0.149: IC17.16 20.76,18.97 22.95,16.78 27.2,16.78 28.3,17.88 IC11.55
!DTR2_OUT  (via drill 0.15 pad 0.35)
  SIGNAL-HS 0.149: IC17.5 15.13,18.97 v15,19.1
  SIGNAL 0.149: v15,19.1 15.18,18.92 15.86,18.92 20.48,14.3 v24.4,14.3
  SIGNAL-HS2 0.149: v24.4,14.3 24.4,14.85 UART2.7
!GRST
  SIGNAL-HS 0.149: IC1.14 63.51,26.71 65.21,25.01 !RST.TP 67.8,23.62 67.81,23.61 | 67.81,23.61 C42.1 67.28,22.68 67.02,22.41 | 67.81,23.61 R3.2 | 67.02,22.41 D1.1 | C54.1 69.45,19.8 69.36,19.7 68.6,19.7 67.98,20.32 67.98,21.38 67.02,22.34 67.02,22.41
  SIGNAL-HS 0.254: IC3.9 70.67,19.82 R9.2 69.94,19.8 C54.1
!OVERCUR1  (via drill 0.15 pad 0.35)
  SIGNAL-HS 0.149: IC1.26 67.46,32.96 68.68,31.74 v69.2,31.74 | v55.78,56.29 55.7,56.38 IC4.10
  SIGNAL 0.149: v69.2,31.74 68.73,31.74 68.07,32.39 68.07,42.27 61.7,48.63 61.7,55.06 60.47,56.29 v55.78,56.29
!OVERCUR2  (via drill 0.15 pad 0.35)
  SIGNAL-HS 0.149: IC4.6 55.7,59.27 55.72,59.3 v55.72,59.67 | v69.99,30.93 69.85,30.93 69.75,30.83 68.65,30.83 67.32,32.16 IC1.24
  SIGNAL 0.149: v55.72,59.67 55.74,59.69 60.34,59.69 62.68,57.35 62.68,49.04 69.18,42.54 69.18,36.96 69.65,36.5 69.65,32.35 69.99,32.01 v69.99,30.93
!OVERCUR3  (via drill 0.15 pad 0.35)
  SIGNAL-HS 0.149: IC1.22 65.49,31.33 v66.46,31.33 | IC5.10 55.66,48.83 v55.72,48.77
  SIGNAL 0.149: v55.72,48.77 59.72,48.77 66.31,42.18 66.31,31.48 v66.46,31.33
!OVERCUR4  (via drill 0.15 pad 0.35)
  SIGNAL-HS 0.149: IC5.6 55.66,51.83 55.79,51.95 v55.79,52.25 | v67.74,29.99 67.17,30.56 IC1.20
  SIGNAL 0.149: v55.79,52.25 60.79,52.25 61.38,51.66 61.38,48.5 67.31,42.57 67.31,35.54 67.29,35.53 67.29,33.27 67.74,32.82 v67.74,29.99
!PCIE_PRSNT  (via drill 0.2 pad 0.35)
  SIGNAL-HS 0.203: PCIE-1X1.B17 63.75,9.61 63.94,9.8 64.44,9.8 64.7,10.06 64.7,10.56 v64.86,10.72
  SIGNAL 0.203: v45.59,13.08 45.98,12.69 48.44,12.69 51.26,9.87 56.9,9.87 58.45,8.32 62.35,8.32 63.82,9.79 64.44,9.79 64.86,10.21 v64.86,10.72
  SIGNAL-HS2 0.203: v45.59,13.08 45.59,4.28 PCIE-1X1.A1
!PECREQ
  SIGNAL-HS 0.149: IC1.13 63.11,28.26 63.18,28.19 63.18,26.4 64.01,25.57 !REQ.TP
!PERST  (via drill 0.15 pad 0.35)
  SIGNAL-HS 0.149: v56.55,9.22 57.51,10.18 57.51,22.51 | IC1.2 58.71,27.56 58.44,27.29 58.44,25.55 57.51,24.62 57.51,22.51 | !PERST.TP 57.51,22.51
  SIGNAL-HS2 0.149: PCIE-1X1.A11 55.75,8.42 v56.55,9.22
!PWRON1  (via drill 0.15 pad 0.35)
  SIGNAL-HS 0.149: IC1.27 66.27,33.36 66.33,33.3 67.88,33.3 68.86,32.33 v68.86,32.17 | v60.07,58.78 59.77,58.78 59.48,58.48 IC4.4
  SIGNAL 0.149: v68.86,32.17 68.4,32.63 68.4,42.4 62.03,48.77 62.03,57.08 60.33,58.78 v60.07,58.78
!PWRON2  (via drill 0.15 pad 0.35)
  SIGNAL-HS 0.149: IC4.5 59.46,58.98 v59.78,59.3 | v69.53,31.32 69.47,31.26 68.68,31.26 67.39,32.56 IC1.25
  SIGNAL 0.149: v69.53,31.32 69.61,31.4 69.61,31.89 69.31,32.2 69.31,36.04 69.32,36.05 69.32,36.37 68.86,36.83 68.86,42.41 62.36,48.91 62.36,57.22 60.27,59.31 v59.79,59.31 v59.78,59.3
!PWRON3  (via drill 0.15 pad 0.35)
  SIGNAL-HS 0.149: IC1.23 67.25,31.76 68.18,30.83 v68.18,30.45 | v60.09,51.34 59.84,51.34 59.48,50.98 IC5.4
  SIGNAL 0.149: v68.18,30.45 68.12,30.39 68.12,29.83 67.9,29.61 67.58,29.61 66.97,30.23 66.97,31.11 67.09,31.23 67.09,32.55 66.64,33 66.64,42.31 60.72,48.23 60.72,50.91 60.29,51.34 v60.09,51.34
!PWRON4  (via drill 0.15 pad 0.35)
  SIGNAL-HS 0.149: IC5.5 59.47,51.48 v59.82,51.83 | v67.35,30.95 67.3,30.9 66.02,30.9 65.96,30.96 IC1.21
  SIGNAL 0.149: v59.82,51.83 60.43,51.83 61.05,51.21 61.05,48.36 66.98,42.43 66.98,35.68 66.97,35.66 66.97,33.13 67.41,32.69 67.41,31.02 v67.35,30.95
!RI1
  SIGNAL-HS 0.149: IC16.20 18.6,23.2 19.13,22.67 IC11.46
!RI1_OUT  (via drill 0.15 pad 0.35)
  SIGNAL-HS 0.149: IC16.1 17.13,23.6 v17.6,23.6
  SIGNAL 0.149: v17.6,23.6 19.56,23.6 20.44,22.72 25.5,22.72 25.77,22.45 26.89,22.45 26.96,22.37 28.2,22.37 28.3,22.37 30.79,22.37 32.64,20.52 35.56,20.52 37.92,18.16 37.92,17.84 38.14,17.62 42.08,17.62 v42.3,17.4
  SIGNAL-HS2 0.149: UART1.3 40.86,21.13 42.45,21.13 42.7,20.88 42.7,19.7 43.12,19.29 43.12,17.7 42.87,17.45 42.35,17.45 v42.3,17.4
!RI2
  SIGNAL-HS 0.149: IC17.20 18.6,16.38 19.49,15.49 29.33,15.49 30.3,16.46 IC11.59
!RI2_OUT  (via drill 0.15 pad 0.35)
  SIGNAL-HS 0.149: IC17.1 16.6,17.03 16.3,16.73 v16.3,16.6
  SIGNAL 0.149: v16.3,16.6 15.95,16.95 14.75,16.95 13.63,18.08 13.63,21.85 14.88,23.1 19.29,23.1 20.46,21.93 v20.8,21.93
  SIGNAL-HS2 0.149: v20.8,21.93 21.33,21.4 23.9,21.4 24.4,20.9 24.4,18.95 UART2.8
!RTS1
  SIGNAL-HS 0.149: IC11.40 21.47,25.67 20.57,26.57 IC16.14
!RTS1_OUT  (via drill 0.15 pad 0.35)
  SIGNAL-HS 0.149: IC16.7 14.97,26.57 v14.9,26.5
  SIGNAL 0.149: v14.9,26.5 15.1,26.5 16.42,27.82 20.92,27.82 23.47,25.27 33.82,25.27 35.24,26.7 40.3,26.7 42.7,24.3 42.7,19.9 v42.3,19.5
  SIGNAL-HS2 0.149: v42.3,19.5 41.93,19.13 UART1.7
!RTS2
  SIGNAL-HS 0.149: IC17.14 21.02,19.97 23.5,17.49 26.56,17.49 27.3,18.23 IC11.53
!RTS2_OUT  (via drill 0.15 pad 0.35)
  SIGNAL-HS 0.149: IC17.7 15.33,19.97 v15.02,20.28
  SIGNAL 0.149: v15.02,20.28 14.71,20.6 14.71,21.42 14.62,21.51 14.62,21.82 15.25,22.45 19.02,22.45 22.86,18.6 24.6,18.6 v27,21
  SIGNAL-HS2 0.149: v27,21 27,18.95 UART2.4
!SMI
  SIGNAL-HS 0.149: IC1.1 58.31,27.63 58.11,27.43 58.11,27.06 58.11,26.39 !SMI.TP
!WAKE  (via drill 0.15 pad 0.35, 0.2 pad 0.35)
  SIGNAL-HS 0.149: IC1.3 59.11,28.19 v59.14,28.16 | v56.77,20.34 56.48,20.05 R1.2
  SIGNAL-HS 0.203: C10.1 56.47,19.09 R1.2
  SIGNAL-HS2 0.149: v59.14,28.16 58.94,28.16 57.39,26.61 57.39,20.96 v56.77,20.34
!WAKE_R
  SIGNAL-HS 0.149: R1.1 56.48,11.36 55.75,10.63 PCIE-1X1.B11
+1V1
  SIGNAL-HS 0.152: IC21.50 22.19,41.45 22.56,41.82 C123.1
  SIGNAL-HS 0.203: C126.1 23.31,38.46 22.32,39.45 IC21.45 20.44,39.45 | C124.1 13.49,40.65 IC21.23 15.5,40.65 15.78,40.37 15.78,39.21 16.06,38.93 19.92,38.93 20.44,39.45 | IC21.50 20.33,41.45 20.17,41.29 20.17,39.72 20.44,39.45
+1V05  (via drill 0.15, 0.15 pad 0.35)
  SIGNAL-HS 0.149: C17.1 v58.1,35.36 IC1.54 | C21.1 IC1.60 v58.1,32.96 | C19.1 v56.89,31.75 IC1.63 v58.09,31.76 v58.1,31.75 | C28.1 v61.51,28.37 IC1.9 v61.5,29.56 | v62.71,29.56 IC1.12 C26.1 | 64.92,33.76 IC1.28 C24.1 | 64.92,33.76 | 64.92,33.76 v64.92,33.74 | v63.9,36.36 63.91,36.37 IC1.37 C22.1 | v61.51,36.36 IC1.43 61.51,37.64 | v60.32,36.36 60.31,36.37 IC1.46 60.31,37.09 | 61.51,37.64 C20.1 | v60.91,37.6 61.47,37.6 61.51,37.64
  SIGNAL-HS 0.2: C18.1 60.31,37.09 | C20.1 IC1.43
  SIGNAL-HS 0.254: IC3.1 76.03,22.83 v76.1,22.9 76.1,24.63 C53.1 76.1,24.89 v76.1,25.9 v76.1,26.65 | IC3.20 76.58,22.22 v76.5,22.3 | IC3.20 IC3.19 | IC3.19 IC3.18 77.47,20.47 v77.6,20.6 77.79,20.41 R10.1 | IC3.19 77.52,21.12 v77.6,21.2 | IC3.20 77.47,21.77 v77.6,21.9 | v76.85,26.65 v76.85,25.9
  PWR 0.254: 64.71,33.64 64.82,33.64 v64.92,33.74
  PWR 0.406: v58.1,31.75 v58.1,32.96 58.1,33.2 57.51,33.79 57.51,34.77 v58.1,35.36 58.1,36.65 58.4,36.95 59.73,36.95 v60.32,36.36 v61.51,36.36 v63.9,36.36 64.1,36.36 64.38,36.08 64.38,33.96 64.71,33.64 64.87,33.47 64.87,29.4 64.44,28.97 63.67,28.97 63.08,29.56 v62.71,29.56 v61.5,29.56
  SIGNAL-HS2 0.149: C25.1 66.41,33.48 66.29,33.48 66.03,33.74 v64.92,33.74 | C27.1 v60.91,37.6 | C29.1 56.89,31.89 v56.89,31.75 | C23.1 61.67,27.95 61.51,28.11 v61.51,28.37
  pour PWR (isolate 0.203, no thermals): 75.25,26.75 75.25,22.5 75.5,22.25 76,22.25 76,20.25 76.25,20 79.25,20 79.5,20.25 79.5,23 79.26,23.24 77.51,23.24 77.15,23.57 77.15,27 75.5,27
  pour SIGNAL-HS (isolate 0.203, no thermals): 75.25,26.75 75.25,22.5 75.5,22.25 76,22.25 76,20.25 76.25,20 79.26,20 79.5,20.24 79.5,23 79.26,23.24 77.51,23.24 77.17,23.58 77.17,27 75.5,27
  pour PWR (isolate 0.203): 77,25.5 75.4,25.5 75.4,26.7 74.6,27.5 67.2,34.9 67.2,35.3 66.4,36.1 63.6,36.1 63.4,36.3 57.6,36.3 57.6,37.7 67.2,37.7 68.4,36.5 77.4,27.5 77.4,25.5
+1V8  (via drill 0.15 pad 0.35)
  SIGNAL-HS 0.149: C96.1 22.11,27.17 v22.2,27.17 IC11.37
  SIGNAL-HS 0.203: C95.1 36.17,27.17 v35.8,27.17 IC11.12 33.27,27.17 32.52,27.92 v32.52,28.22 | v32.8,20.9 IC11.64 32.8,19.4 | C98.1 33.23,18.27 v32.95,18.55 32.8,18.7 32.8,19.4 | C99.1 v33.3,19.35 32.85,19.35 32.8,19.4 | C97.1 25.29,19.21 25.3,19.2 IC11.49 v25.3,20.9 v25.29,20.9 | v24.73,27.17 IC11.37
  pour PWR (isolate 0.203): 21.3,27.6 36.1,27.6 36.4,27.3 36.4,26.9 36.3,26.8 33.4,26.8 33.4,18.4 32.1,18.4 32.1,24.9 31.6,25.4 26.6,25.4 25.4,24.2 25.4,19.1 25.1,18.8 24.6,18.8 24.4,19 24.4,25.9 23.5,26.8 21.4,26.8 21.2,27 21.2,27.5
+3V3  (via drill 0.15, 0.15 pad 0.35, 0.2 pad 0.35)
  SIGNAL-HS 0.149: C38.1 IC1.57 v58.1,34.16 | v58.11,30.56 IC1.66 C39.1 | v63.91,29.56 IC1.15 63.91,28.19 64.01,28.09 C30.1 64.61,27.95 v64.62,27.97 | IC1.29 64.93,34.16 v64.91,34.18 | v59.11,36.36 IC1.49 59.11,37.01 | C34.1 v62.71,37.5 IC1.40 | D1.3 69.09,23.39 R3.1 69.66,23.61 v69.68,23.63 | D1.3 69.11,21.36 v70.18,21.36 | D1.3 69.09,20.22 v69.18,20.13
  SIGNAL-HS 0.152: R5.1 74.28,31.33 74.92,30.69 74.92,28.23 73.77,27.08 72.7,27.08 72.7,26.2 72.12,25.62
  SIGNAL-HS 0.2: 59.11,37.01 C36.1 59.53,37.99 v59.71,38.17 | C34.1 63.12,38.01 v63.3,38.18
  SIGNAL-HS 0.203: v55.8,28.7 54.2,28.7 53.82,28.32 R2.1
  SIGNAL-HS 0.254: IC3.7 IC3.6 71.04,21.77 v70.93,21.88 | IC3.7 IC3.8 71.02,20.47 v70.93,20.38 | IC3.7 v70.94,21.12 v70.93,21.13 | IC3.10 71.86,18.45 v71.93,18.38 | R9.1 70.65,18.66 v70.68,18.63 | R6.1 70.96,16.85 v70.93,16.88 | v53.82,26.5 53.82,25.88
  SIGNAL-HS 0.406: v53.22,26.5 v53.22,25.9 v54.42,25.9 v54.42,26.5 | v54.42,26.5 v53.82,26.5 v53.22,26.5 | v53.22,26.5 53.22,26.3 53.82,26.3 54.42,26.3 v54.42,26.5
  SIGNAL-HS 0.61: J2.2 53.13,23.43 53.82,24.12 53.82,25.88 53.82,26.3 v53.82,26.5 R2.1 | C46.1 72.12,25.62 72.71,26.21
  PWR 0.406: v58.11,30.56 58.76,30.56 | v59.11,36.36 58.76,36.01 58.76,34.13 | 58.76,30.56 58.76,34.13 | v58.1,34.16 58.73,34.16 58.76,34.13 | 58.76,30.56 59.12,30.2 63.27,30.2 v63.91,29.56
  SIGNAL 0.254: v62.71,37.5 62.71,36.77 64.35,35.13 64.35,34.38 64.55,34.18 v64.91,34.18
  SIGNAL-HS2 0.149: C41.1 64.61,27.95 v64.62,27.97
  SIGNAL-HS2 0.203: C32.1 66.56,34.14 | 66.56,34.14 C40.1 | 66.56,34.14 66.53,34.18 v64.91,34.18
  other vias: 53.82,25.9 71.18,25.38 71.18,24.88 71.18,24.38 72.18,22.88
  pour PWR (isolate 0.203, no thermals): 73.12,26.84 73.12,22.29 73.07,22.24 73,22.17 72.64,22.17 72.5,22.03 72.5,19.21 72.5,16.52 72.27,16.29 56.47,16.29 52.96,19.8 52.45,20.31 52.45,26.7 52.67,26.92 54.48,26.92 54.63,26.77 54.63,22.11 57.71,19.03 67.41,19.03 68.78,20.4 68.78,24.19 68.78,26.46 69.31,26.99 69.43,27.11 72.88,27.11 72.93,27.11 73.1,26.94 73.12,26.92 73.12,26.87
  pour SIGNAL-HS (isolate 0.203, no thermals): 68.83,26.53 68.83,19.77 69.9,18.7 72.44,18.7 72.44,22.14 72.5,22.2 72.9,22.2 73.06,22.36 73.06,26.94 72.94,27.06 69.36,27.06
  pour PWR (isolate 0.203, rank 4): 52.4,26.1 52.4,27.7 52.8,28.1 54,29.3 55.6,29.3 56.6,30.3 56.6,35.9 65.4,35.9 65.6,35.7 65.6,29.7 64.4,28.5 61,28.5 56.4,28.5 55,27.1 54.8,26.9 54.8,25.5 52.4,25.5
  pour PWR (isolate 0.203, rank 6, no thermals): -1.97,70.5 90,70.5 90,12.45 66.34,12.45 66.34,5.82 41.93,5.82 41.93,3.88 32.81,3.88 32.81,12.5 17,12.5 17,3.5 -1.97,3.5
+3V3_AUX
  SIGNAL-HS 0.149: 54.85,15.7 AUX3.TP
  SIGNAL-HS 0.203: 54.82,15.93 AUX3.TP
  SIGNAL-HS 0.508: PCIE-1X1.B10 54.75,15.59 54.85,15.7 | J2.3 54.59,19.91 54.59,16.16 54.82,15.93
+3V3A  (via drill 0.15, 0.15 pad 0.35)
  SIGNAL-HS 0.149: v60.3,29.56 IC1.6 v60.31,28.34 C37.1 | v64.91,35.36 IC1.32 C35.1 | R2.2 v56.43,27.5 v56.44,27.49 v57.04,27.49 | v57.04,28.09 v57.04,27.5 v57.04,27.49 | v57.04,27.49 v57.04,26.9 v57.04,26.89
  SIGNAL-HS 0.406: R2.2 v57.04,27.5 | v56.44,28.09 v56.44,26.89 56.8,26.89 | v57.04,26.9 v57.04,28.09 56.8,28.09 56.8,26.89 | v57.04,26.89 56.8,26.89
  SIGNAL-HS2 0.149: C31.1 66.39,35.36 v64.91,35.36 | C33.1 60.31,27.96 v60.31,28.34
  pour PWR (isolate 0.203, no thermals): 57.4,26.5 56.3,26.5 56.3,28.2 57.8,29.7 60.53,29.7 60.57,29.66 60.57,28.77 60.94,28.4 64.65,28.4 65.8,29.55 65.8,34.47 65.33,34.94 64.86,34.94 64.75,35.05 64.75,35.69 65.91,35.69 66.4,35.2 66.4,29.16 64.94,27.7 58.6,27.7
+3V3B  (via drill 0.15 pad 0.35)
  SIGNAL-HS 0.149: IC9.55 C74.1 42.62,34.48 v42.6,34.5 | IC9.44 37.71,34.09 C73.1 | IC9.43 37.21,34.45 C72.1 36.74,34.07 35.67,34.07 35.58,34.16 | C71.1 IC9.32 | IC9.27 37.71,44.45 C70.1 | IC9.17 v42.71,43.9 | IC9.11 45.52,41.04 C68.1 | IC9.7 45.48,39.04 C67.1 | IC9.3 45.4,37.04 C66.1 | R19.1 35.48,34.26 35.58,34.16 | 35.58,34.16 35.14,33.73 D8.C 33.03,33.73 v32.9,33.86 | R20.2 45.02,43.53 IC8.8 45.87,43.37 C77.1
  SIGNAL-HS 0.254: 37.71,44.45 37.67,44.49 v37.06,44.49 | v37.13,34.73 37.21,34.81 IC9.43 IC9.44 | C69.1 v42.71,43.9 | C77.1 45.47,42.63 v45.2,42.9 | C68.1 46.09,40.98 v46.1,41 | 45.48,39.04 45.55,39.1 v46.1,39.1 | C66.1 45.95,36.95 v46,37 | C71.1 35.51,40.99 v34.24,40.99 | C83.1 25,65.92 v25.31,65.61 IC7.20 | IC10.20 v25.37,57.49 25.09,57.77 C82.1 | R21.2 44.55,45.67 v44.01,45.67
  SIGNAL-HS 0.305: C78.1 IC6.5 v34.2,47.12
  SIGNAL-HS 0.508: C81.1 v32.85,47.12 IC6.5
  PWR 0.254: 36.5,45.05 v37.06,44.49 | 36.5,45.05 36.5,46.6 35.98,47.12 v34.2,47.12 v32.85,47.12 v32.85,47.99 v32.84,48 v33.59,48 34.2,48 v34.23,47.97 | 36.5,45.05 36.1,44.65 36.1,40.92 | v32.9,33.86 33.14,33.62 35.02,33.62 36.1,34.7 | 36.1,40.92 36.1,34.7 | 36.1,34.7 37.1,34.7 v37.13,34.73 42.37,34.73 v42.6,34.5 42.6,34.6 43.5,35.5 44.4,35.5 44.8,35.9 44.8,37 | 44.8,37 44.8,39.1 | 44.8,39.1 44.8,41 | 44.8,41 44.8,42.5 v45.2,42.9 45.2,43.3 44.6,43.9 v42.71,43.9 | v46.1,41 44.8,41 | v46.1,39.1 44.8,39.1 | v46,37 44.8,37 | v34.24,40.99 36.03,40.99 36.1,40.92
  SIGNAL-HS2 0.149: RN5.A2 RN5.B2 RN5.C2 RN5.D2 | RN6.A2 RN6.B2 RN6.C2 RN6.D2
  SIGNAL-HS2 0.254: RN5.A2 v16.42,66.69 | RN5.D2 v16.42,62.78 RN6.A2 | RN6.D2 v16.43,58.82 16.43,57.92 RN11.A2 RN11.B2 RN11.C2 RN11.D2 v16.46,54.65 16.46,53.86 RN12.A2 RN12.B2 RN12.C2 RN12.D2 16.48,50.81 v16.46,50.79
  pour PWR (isolate 0.203): 32.9,48.56 32.72,48.38 32.72,46.93 33.35,46.3 33.35,45.08 33.04,44.77 30.62,44.77 30.21,45.18 30.21,66.57 29.77,67.01 14.93,67.01 14.93,50.49 26.94,50.49 26.94,45.52 32.22,40.24 32.22,33.74 32.62,33.34 44.17,33.34 46.38,35.55 46.38,44.43 44.98,45.83 38.15,45.83 35.41,48.57 33.03,48.57
+3V3C  (via drill 0.15, 0.15 pad 0.35, 0.2 pad 0.35)
  SIGNAL-HS 0.149: IC17.19 20.13,17.47 | 20.13,17.47 v20.18,17.47 | v20.12,24.04 20.08,24.07 IC16.19 20.09,24.07 20.28,23.89 C111.1 | IC15.19 v20.24,31.07 20.75,31.07 C109.1 | IC11.50 25.77,19.77 v25.77,20.83 | IC11.56 v28.8,20.81 | v25.81,30.06 v25.8,30.07 IC11.31 25.8,32.42 C89.1 | IC11.9 34.68,25.72 v33.2,25.72 | IC11.4 33.24,23.17 32.81,22.74 31.49,22.74 v31.47,22.72 | IC13.5 45.42,24.49 45.33,24.58 | R25.1 36.44,14.3 R26.1 36.42,15.22 R24.1 36.4,16.05 v36.2,16.24 34.55,16.24 | 34.55,16.24 IC12.6 | C84.1 34.56,16.25 34.55,16.24 | 23.39,24.65 IC11.42 | C88.1 31.3,32.16 IC11.20 v31.3,30.02 31.37,29.95 33.41,29.95 33.5,30.04 R31.1 34.21,31.05 R32.1 | C113.1 20.13,16.82 20.13,17.47 | 25.8,18.57 v26.33,18.57
  SIGNAL-HS 0.203: IC11.50 25.8,18.57 C91.1 | IC11.56 C92.1 | IC11.9 v35.8,25.67 36.13,25.67 C87.1 | v43.1,23.6 43.13,23.63 C103.1 44.73,23.63 v44.8,23.7
  SIGNAL-HS 0.254: C103.1 44.17,23.84 v44.17,24.3 C102.1 44.66,24.75 v44.7,24.71 45.2,24.71 45.33,24.58 | v22.22,24.66 IC11.42 23.39,24.65
  SIGNAL-HS2 0.149: C90.1 21.91,24.66 v22.22,24.66
  SIGNAL-HS2 0.203: C94.1 36.5,26.37 v35.8,25.67
  SIGNAL-HS2 0.254: R33.1 v26.61,28.99 v26.6,29
  SIGNAL-HS2 0.406: C93.1 25.01,24.65 21.92,24.65 21.91,24.66
  pour PWR (isolate 0.203, rank 2): 19.5,30.4 19.5,16.3 19.7,16.1 36.3,16.1 40.7,20.5 44.4,20.5 45,21.1 45,25.4 44,26.4 40.7,26.4 36.7,30.4 23.8,30.5 23.4,30.5 22.4,31.5 20.6,31.5
+3V3D  (via drill 0.15 pad 0.35)
  SIGNAL-HS 0.149: C129.1 27.46,43.13 IC22.8 | C134.1 IC25.5 | R65.1 12.61,38.72 v12.59,38.7
  SIGNAL-HS 0.152: C117.1 22.73,41.05 IC21.49 21.35,40.85 IC21.48 | IC21.44 21.35,38.86 IC21.43
  SIGNAL-HS 0.203: 21.35,38.86 21.36,38.85 21.96,38.85 22.2,38.61 C125.1 | C118.1 IC21.42 20.51,38.64 v20.45,38.7 20.5,38.65 IC21.43 | C119.1 IC21.33 v16.91,38.48 | C120.1 13.39,41.05 IC21.22 15.23,41.05 v15.28,41.1 | C121.1 IC21.10 16.91,43.98 v16.89,43.96 | C122.1 20.51,45.8 IC21.1 20.51,44 v20.48,43.97 | C131.1 11.61,37.04 IC24.5 v12.27,36.86 v12.28,36.85 | IC23.5 12.08,48.11 C130.1
  SIGNAL-HS 0.305: 21.35,40.85 v20.63,40.85 | IC23.5 12.97,47.91 v13,47.88 | C129.1 27.41,43.18 v26.88,43.18
  SIGNAL-HS 0.406: IC25.5 v25.53,36.79 v25.52,36.78 | v25.52,36.78 v25.52,37.45 | v25.52,36.78 v25.52,36.15
  SIGNAL-HS2 0.406: C135.1 26.38,36.78 v25.52,36.78
  pour PWR (isolate 0.203): 27.7,37.5 27.7,43.4 26.6,44.5 26,45.1 26,49.7 7.8,49.7 7.8,35.5 19.1,35.5 20,34.6 27.7,34.6
+5V  (via drill 0.15 pad 0.35)
  SIGNAL-HS 0.152: R12.1 73.46,30.55 73.46,32.86 74.02,33.42 77.54,33.42 77.87,33.75 77.87,43.55 77.25,44.17 v76.34,44.17
  SIGNAL-HS 0.61: 71.05,47.84 C51.1 70.78,47.57 R7.1
  PWR 0.254: v76.34,44.17 75.33,44.17 74.66,44.84 74.66,45.72 72.54,47.84 v69.38,47.84
  other vias: 64.38,59.84 64.38,58.84 64.38,57.84 64.38,56.84 64.38,55.84 64.38,54.84 64.38,53.84 63.38,53.84 63.38,54.84 63.38,55.84 63.38,56.84 63.38,57.84 63.38,58.84 63.38,59.84
  pour SIGNAL-HS (isolate 0.203, no thermals): 69.12,62.23 61.48,62.23 61.48,58.59 61.26,58.37 58.27,58.37 58.27,57.47 61.23,57.47 61.45,57.25 61.45,51.2 61.09,50.84 58.29,50.84 58.29,49.87 61.04,49.87 61.34,49.57 61.34,47.66 62.12,46.88 68.78,46.88 69.69,45.97 71.03,45.97 71.5,46.44 71.5,47.22 71.64,47.36 72.43,47.36 72.8,47.73 72.8,49.12 72.67,49.25 70.17,49.25 69.12,50.3
+12V  (via drill 0.15 pad 0.35, 0.2 pad 0.35)
  SIGNAL-HS 0.254: C2.1 46.03,16.81 | 46.03,16.81 v46.05,16.81 v46.98,16.81 | C3.1 v46.04,17.89 | C5.1 v46.02,19 v46.03,18.99 v46.03,17.9 v46.04,17.89 | C9.1 45.85,16.63 46.03,16.81 | v46.96,17.88 v46.05,17.88 v46.04,17.89 | C45.1 81.75,48.23 v81.73,48.25 | C47.1 83.98,47.3 v83.98,48.25 | v83.98,48.25 v83.98,49 v83.23,49 v82.48,49 v81.73,49 v81.73,48.25 | v81.73,48.25 v82.48,48.25 v83.23,48.25 v83.98,48.25
  SIGNAL-HS 0.508: PCIE-1X1.B2 47.26,3.77 | 47.26,3.77 PCIE-1X1.B3 | PCIE-1X1.B2 46.3,3.77 | 46.3,3.77 PCIE-1X1.B1 | 46.3,3.77 46.3,13.16 46.5,13.36 | 46.5,13.36 v46.67,13.53 47.26,12.94 47.26,3.77 | PCIE-1X1.B2 46.75,13.11 46.5,13.36
  SIGNAL-HS2 0.254: C4.1 47,17.92 v46.96,17.88 | C1.1 v46.99,16.82 | v46.99,16.82 v46.98,16.81 | C6.1 46.99,15.4 v46.99,16.82
  SIGNAL-HS2 0.508: 47.29,3.77 PCIE-1X1.B2 46.81,3.83 46.81,13.39 v46.67,13.53 47.29,12.91 47.29,3.77 | 47.29,3.77 PCIE-1X1.B3
  pour SIGNAL-HS2 (isolate 0.203, no thermals): 46.58,5.31 46.58,12.87 45.43,14.02 45.43,19.59 48.41,19.59 48.41,16.36 47.94,15.89 47.94,5.44 47.81,5.31
  pour SIGNAL-HS (isolate 0.203, no thermals): 45.53,3.98 45.53,12.3 45.11,12.72 45.11,15.71 44.64,16.18 44.64,19.59 47.98,19.59 47.98,4.21 47.71,3.94 45.57,3.94
  pour SIGNAL-HS (isolate 0.203, no thermals): 78.75,48.25 80.75,48.25 80.75,49.25 85,49.25 85,46.75 81,46.75 80.25,47.5 78.75,47.5
  pour PWR (isolate 0.203, no thermals): 42.9,19.5 49.9,19.5 53.7,15.7 77.1,15.7 80.61,19.21 80.61,50.75 87.97,50.75 87.97,12.9 43.7,12.9 42.9,13.7
BOOT  (via drill 0.15, 0.15 pad 0.35)
  SIGNAL-HS 0.149: SW2.1 57.09,40.26 56.13,41.22 v55.19,41.22 | v28.92,42.85 28.54,43.23 R53.1
  SIGNAL-HS2 0.149: v28.92,42.85 29.05,42.98 43.9,42.98 45.24,41.64 54.77,41.64 v55.19,41.22
BOOT_5V
  SIGNAL-HS 0.61: IC2.1 74.09,50.2 74.53,50.64 C50.1
BUF_PB0
  SIGNAL-HS 0.149: RN3.A1 29.75,66.08 28.58,66.08 27.9,65.41 arc-90 27.67,65.41 arc90 27.44,65.41 27.41,65.37 arc90 27.41,65.14 arc-90 27.41,64.91 27.15,64.66 27.15,64.41 26.8,64.05 IC7.18
BUF_PB1
  SIGNAL-HS 0.149: RN3.B1 29.32,65.09 arc-90 29.16,65.25 29.16,65.44 arc90 28.99,65.6 28.92,65.6 arc90 28.75,65.44 28.75,65.25 arc-90 28.59,65.09 28.3,65.09 26.76,63.55 IC7.17
BUF_PB2
  SIGNAL-HS 0.149: IC7.16 26.74,63.05 27.96,64.27 27.99,64.27 arc-90 28.15,64.11 28.15,64.07 arc90 28.32,63.91 28.34,63.91 arc90 28.5,64.07 28.5,64.11 arc-90 28.67,64.27 28.69,64.27 arc-90 28.85,64.11 28.85,64.07 arc90 29.02,63.91 29.04,63.91 arc90 29.2,64.07 29.2,64.11 arc-90 29.37,64.27 RN3.C1
BUF_PB3
  SIGNAL-HS 0.149: IC7.15 26.75,62.55 27.68,63.48 27.95,63.48 arc-90 28.11,63.32 28.11,63.25 arc90 28.27,63.09 28.3,63.09 arc90 28.46,63.25 28.46,63.32 arc-90 28.62,63.48 28.65,63.48 arc-90 28.81,63.32 28.81,63.25 arc90 28.98,63.09 29,63.09 arc90 29.17,63.25 29.17,63.32 arc-90 29.33,63.48 RN3.D1
BUF_PB4
  SIGNAL-HS 0.149: RN4.A1 29.75,62.05 29.04,62.05 arc90 28.88,61.89 28.88,61.85 arc-90 28.71,61.69 28.71,61.69 arc-90 28.55,61.85 28.55,61.89 arc90 28.39,62.05 28.38,62.05 arc90 28.22,61.89 28.22,61.85 arc-90 28.06,61.69 28.05,61.69 arc-90 27.89,61.85 27.89,61.89 arc90 27.73,62.05 27.73,62.05 arc90 27.56,61.89 27.56,61.85 arc-90 27.4,61.69 27.4,61.69 arc-90 27.23,61.85 27.23,61.89 arc90 27.07,62.05 IC7.14
BUF_PB5
  SIGNAL-HS 0.149: IC7.13 26.72,61.55 27.2,61.07 27.4,61.07 arc90 27.56,61.23 27.56,61.25 arc-90 27.72,61.41 27.73,61.41 arc-90 27.89,61.25 27.89,61.23 arc90 28.05,61.07 28.06,61.07 arc90 28.22,61.23 28.22,61.25 arc-90 28.38,61.41 28.39,61.41 arc-90 28.55,61.25 28.55,61.23 arc90 28.71,61.07 28.71,61.07 arc90 28.88,61.23 28.88,61.25 arc-90 29.04,61.41 29.04,61.41 arc-90 29.21,61.25 29.21,61.23 arc90 29.37,61.07 RN4.B1
BUF_PB6
  SIGNAL-HS 0.149: IC7.12 26.4,61.05 27.04,60.41 27.71,60.41 arc-90 27.87,60.25 27.87,60.16 arc90 28.04,60 28.15,60 arc90 28.31,60.16 28.31,60.25 arc-90 28.47,60.41 28.58,60.41 arc-90 28.75,60.25 28.75,60.16 arc90 28.91,60 29.02,60 arc90 29.18,60.16 29.18,60.25 arc-90 29.34,60.41 29.79,60.41 RN4.C1
BUF_PB7
  SIGNAL-HS 0.149: IC7.11 26.31,60.61 27.45,59.47 RN4.D1
BUF_PD0
  SIGNAL-HS 0.149: IC10.18 26.86,55.91 27.89,56.94 arc90 27.89,57.17 27.8,57.27 arc-90 27.8,57.5 27.84,57.53 arc-90 28.07,57.53 28.16,57.44 arc90 28.39,57.44 28.7,57.75 RN9.A1
BUF_PD1
  SIGNAL-HS 0.149: IC10.17 26.83,55.41 28.37,56.95 28.62,56.95 arc-90 28.78,56.79 28.78,56.59 arc90 28.95,56.43 28.97,56.43 arc90 29.13,56.59 29.13,56.79 arc-90 29.3,56.95 RN9.B1
BUF_PD2
  SIGNAL-HS 0.149: IC10.16 26.84,54.91 28.08,56.15 28.21,56.15 arc-90 28.37,55.99 28.37,55.73 arc90 28.54,55.57 29.09,55.57 arc90 29.25,55.73 29.25,55.99 arc-90 29.42,56.15 RN9.C1
BUF_PD3
  SIGNAL-HS 0.149: IC10.15 26.97,54.41 27.71,55.15 27.85,55.15 arc-90 28.01,54.99 28.01,54.92 arc90 28.17,54.76 28.25,54.76 arc90 28.41,54.92 28.41,54.99 arc-90 28.58,55.15 28.65,55.15 arc-90 28.82,54.99 28.82,54.92 arc90 28.98,54.76 29.05,54.76 arc90 29.22,54.92 29.22,54.99 arc-90 29.38,55.15 29.8,55.15 RN9.D1
BUF_PD4
  SIGNAL-HS 0.149: IC10.14 27.1,53.91 27.29,53.72 27.56,53.72 arc-90 27.73,53.56 27.73,53.41 arc90 27.89,53.25 28.01,53.25 arc90 28.17,53.41 28.17,53.56 arc-90 28.33,53.72 28.45,53.72 arc-90 28.61,53.56 28.61,53.41 arc90 28.78,53.25 28.89,53.25 arc90 29.06,53.41 29.06,53.56 arc-90 29.22,53.72 RN10.A1
BUF_PD5
  SIGNAL-HS 0.149: IC10.13 26.93,53.41 27.41,52.93 27.67,52.93 arc-90 27.83,52.77 27.83,52.65 arc90 27.99,52.49 28.08,52.49 arc90 28.24,52.65 28.24,52.77 arc-90 28.41,52.93 28.49,52.93 arc-90 28.65,52.77 28.65,52.65 arc90 28.82,52.49 28.9,52.49 arc90 29.07,52.65 29.07,52.77 arc-90 29.23,52.93 RN10.B1
BUF_PD6
  SIGNAL-HS 0.149: IC10.12 26.83,52.91 27.61,52.13 27.84,52.13 arc-90 28,51.97 28,51.88 arc90 28.17,51.72 28.2,51.72 arc90 28.36,51.88 28.36,51.97 arc-90 28.52,52.13 28.56,52.13 arc-90 28.72,51.97 28.72,51.88 arc90 28.88,51.72 28.91,51.72 arc90 29.08,51.88 29.08,51.97 arc-90 29.24,52.13 RN10.C1
BUF_PD7
  SIGNAL-HS 0.149: IC10.11 25.71,52.47 26.85,51.33 RN10.D1
CH0